# EAGLE design PT08ttl2 (EAGLE 6.6.0)

## Sheet 1 of 2
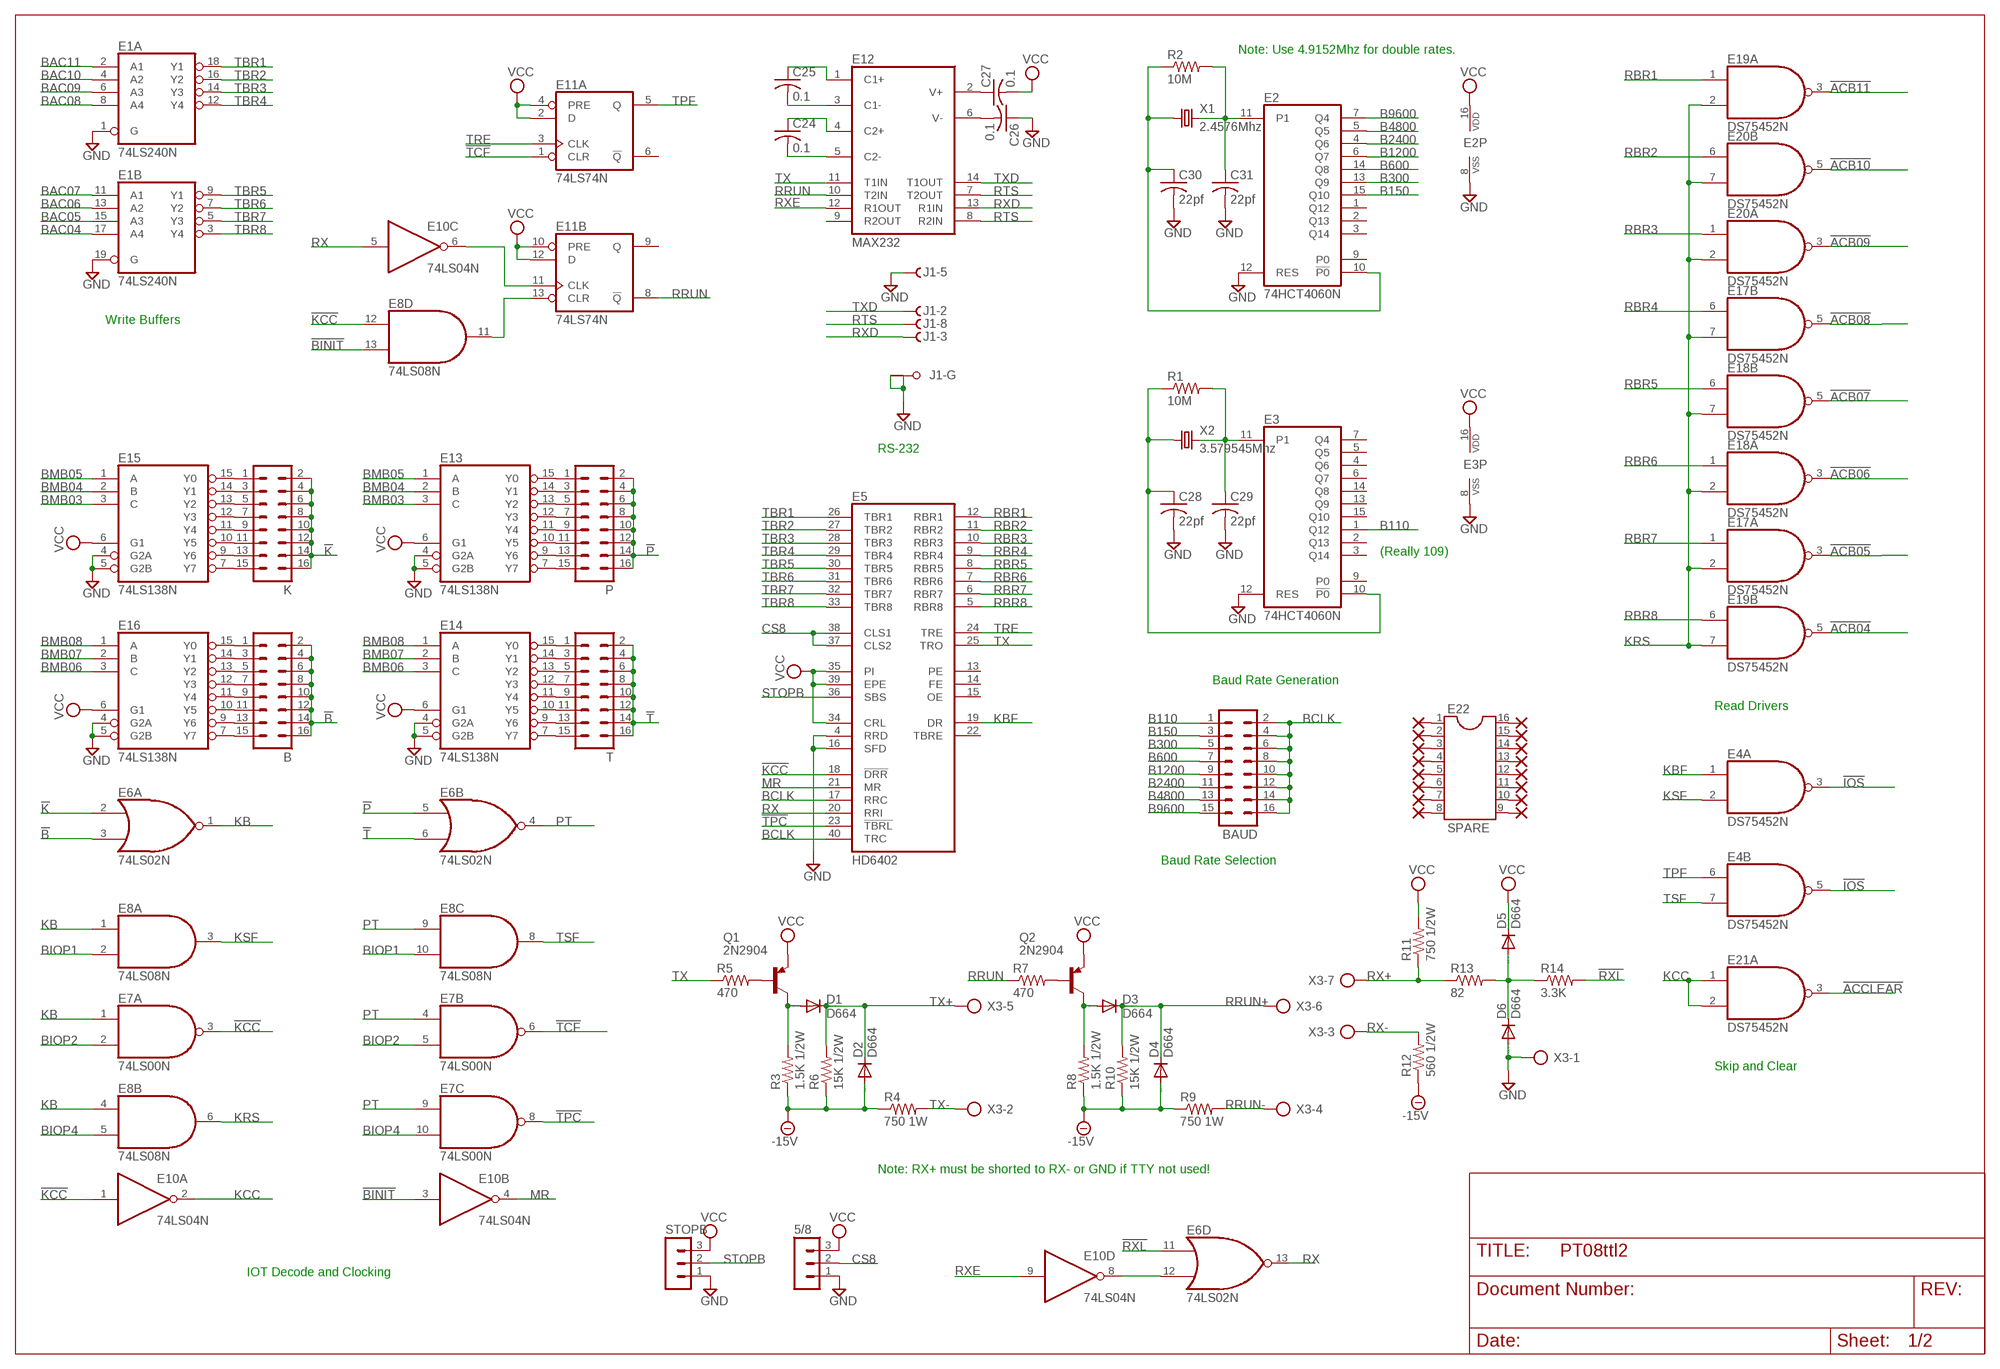
[diagram p0: schematic, sheet 1]

### Parts
5/8  MA03-1  [MA03-1]
B  MA08-2  [MA08-2]
BAUD  MA08-2  [MA08-2]
C24  0.1  C-US050-025X075  [C050-025X075]
C25  0.1  C-US050-025X075  [C050-025X075]
C26  0.1  C-US050-025X075  [C050-025X075]
C27  0.1  C-US050-025X075  [C050-025X075]
C28  22pf  C-US050-025X075  [C050-025X075]
C29  22pf  C-US050-025X075  [C050-025X075]
C30  22pf  C-US050-025X075  [C050-025X075]
C31  22pf  C-US050-025X075  [C050-025X075]
D1  D664  1N4148DO35-10  [DO35-10]
D2  D664  1N4148DO35-10  [DO35-10]
D3  D664  1N4148DO35-10  [DO35-10]
D4  D664  1N4148DO35-10  [DO35-10]
D5  D664  1N4148DO35-10  [DO35-10]
D6  D664  1N4148DO35-10  [DO35-10]
E1  74LS240N  [DIL20]
E2  74HCT4060N  4060N  [DIL16]
E3  74HCT4060N  4060N  [DIL16]
E4  DS75452N  [DIL08]
E5  HD6402  [DIL40]
E6  74LS02N  [DIL14]
E7  74LS00N  [DIL14]
E8  74LS08N  [DIL14]
E10  74LS04N  [DIL14]
E11  74LS74N  [DIL14]
E12  MAX232  [DIL16]
E13  74LS138N  [DIL16]
E14  74LS138N  [DIL16]
E15  74LS138N  [DIL16]
E16  74LS138N  [DIL16]
E17  DS75452N  [DIL08]
E18  DS75452N  [DIL08]
E19  DS75452N  [DIL08]
E20  DS75452N  [DIL08]
E21  DS75452N  [DIL08]
E22  SPARE  DIL16  [DIL16]
J1  F09HPS  [F09HP]
K  MA08-2  [MA08-2]
P  MA08-2  [MA08-2]
PAD18  1,6/0,8  [1,6/0,8]
PAD19  1,6/0,8  [1,6/0,8]
PAD28  1,6/0,8  [1,6/0,8]
PAD29  1,6/0,8  [1,6/0,8]
PAD30  1,6/0,8  [1,6/0,8]
PAD31  1,6/0,8  [1,6/0,8]
PAD32  1,6/0,8  [1,6/0,8]
PAD33  1,6/0,8  [1,6/0,8]
PAD34  1,6/0,8  [1,6/0,8]
PAD35  1,6/0,8  [1,6/0,8]
PAD36  1,6/0,8  [1,6/0,8]
PAD37  1,6/0,8  [1,6/0,8]
PAD38  1,6/0,8  [1,6/0,8]
PAD39  1,6/0,8  [1,6/0,8]
PAD40  1,6/0,8  [1,6/0,8]
PAD41  1,6/0,8  [1,6/0,8]
Q1  2N2904  [TO39]
Q2  2N2904  [TO39]
R1  10M  R-US_0207/10  [0207/10]
R2  10M  R-US_0207/10  [0207/10]
R3  1.5K 1/2W  R-US_0207/10  [0207/10]
R4  750 1W  R-US_0207/10  [0207/10]
R5  470  R-US_0207/10  [0207/10]
R6  15K 1/2W  R-US_0207/10  [0207/10]
R7  470  R-US_0207/10  [0207/10]
R8  1.5K 1/2W  R-US_0207/10  [0207/10]
R9  750 1W  R-US_0207/10  [0207/10]
R10  15K 1/2W  R-US_0207/10  [0207/10]
R11  750 1/2W  R-US_0207/10  [0207/10]
R12  560 1/2W  R-US_0207/10  [0207/10]
R13  82  R-US_0207/10  [0207/10]
R14  3.3K  R-US_0207/10  [0207/10]
STOPB  MA03-1  [MA03-1]
T  MA08-2  [MA08-2]
X1  2.4576Mhz  CRYSTALHC49U-V  [HC49U-V]
X2  3.579545Mhz  CRYSTALHC49U-V  [HC49U-V]
X3  AK300/7  [AK300/7]

### Nets
!ACB04: E19.5(B:O) ; also sheet 2
!ACB05: E17.3(A:O) ; also sheet 2
!ACB06: E18.3(A:O) ; also sheet 2
!ACB07: E18.5(B:O) ; also sheet 2
!ACB08: E17.5(B:O) ; also sheet 2
!ACB09: E20.3(A:O) ; also sheet 2
!ACB10: E20.5(B:O) ; also sheet 2
!ACB11: E19.3(A:O) ; also sheet 2
!ACCLEAR: E21.3(A:O) ; also sheet 2
!B: B.2 B.4 B.6 B.8 B.10 B.12 B.14 B.16 E6.3(A:I1)
!BINIT: E8.13(D:I1) E10.3(B:I) ; also sheet 2
!IOS: E4.3(A:O) E4.5(B:O) ; also sheet 2
!K: E6.2(A:I0) K.2 K.4 K.6 K.8 K.10 K.12 K.14 K.16
!KCC: E5.18(!DRR) E7.3(A:O) E8.12(D:I0) E10.1(A:I)
!P: E6.5(B:I0) P.2 P.4 P.6 P.8 P.10 P.12 P.14 P.16
!RXL: E6.11(D:I0) R14.2
!T: E6.6(B:I1) T.2 T.4 T.6 T.8 T.10 T.12 T.14 T.16
!TCF: E7.6(B:O) E11.1(A:CLR)
!TPC: E5.23(!TBRL) E7.8(C:O)
-15V [supply]: D2.A D4.A R3.1 R4.1 R6.1 R8.1 R9.1 R10.1 R12.1 ; also sheet 2
B110: BAUD.1 E3.1(Q12)
B150: BAUD.3 E2.15(Q10)
B300: BAUD.5 E2.13(Q9)
B600: BAUD.7 E2.14(Q8)
B1200: BAUD.9 E2.6(Q7)
B2400: BAUD.11 E2.4(Q6)
B4800: BAUD.13 E2.5(Q5)
B9600: BAUD.15 E2.7(Q4)
BAC04: E1.17(B:A4) ; also sheet 2
BAC05: E1.15(B:A3) ; also sheet 2
BAC06: E1.13(B:A2) ; also sheet 2
BAC07: E1.11(B:A1) ; also sheet 2
BAC08: E1.8(A:A4) ; also sheet 2
BAC09: E1.6(A:A3) ; also sheet 2
BAC10: E1.4(A:A2) ; also sheet 2
BAC11: E1.2(A:A1) ; also sheet 2
BCLK: BAUD.2 BAUD.4 BAUD.6 BAUD.8 BAUD.10 BAUD.12 BAUD.14 BAUD.16 E5.17(RRC) E5.40(TRC)
BIOP1: E8.2(A:I1) E8.10(C:I1) ; also sheet 2
BIOP2: E7.2(A:I1) E7.5(B:I1) ; also sheet 2
BIOP4: E7.10(C:I1) E8.5(B:I1) ; also sheet 2
BMB03: E13.3(C) E15.3(C) ; also sheet 2
BMB04: E13.2(B) E15.2(B) ; also sheet 2
BMB05: E13.1(A) E15.1(A) ; also sheet 2
BMB06: E14.3(C) E16.3(C) ; also sheet 2
BMB07: E14.2(B) E16.2(B) ; also sheet 2
BMB08: E14.1(A) E16.1(A) ; also sheet 2
CS8: 5/8.2 E5.37(CLS2) E5.38(CLS1)
GND [supply]: 5/8.1 C26.1 C28.2 C29.2 C30.2 C31.2 D6.A E1.1(A:G) E1.19(B:G) E2.8(VSS) E2.12(RES) E3.8(VSS) E3.12(RES) E5.4(RRD) E5.16(SFD) E13.4(G2A) E13.5(G2B) E14.4(G2A) E14.5(G2B) E15.4(G2A) E15.5(G2B) E16.4(G2A) E16.5(G2B) J1.5(-5:F) J1.G1(-G:G1) J1.G2(-G:G2) STOPB.1 X3.1 ; also sheet 2
KB: E6.1(A:O) E7.1(A:I0) E8.1(A:I0) E8.4(B:I0)
KBF: E4.1(A:I0) E5.19(DR)
KCC: E10.2(A:O) E21.1(A:I0) E21.2(A:I1)
KRS: E8.6(B:O) E17.2(A:I1) E17.7(B:I1) E18.2(A:I1) E18.7(B:I1) E19.2(A:I1) E19.7(B:I1) E20.2(A:I1) E20.7(B:I1)
KSF: E4.2(A:I1) E8.3(A:O)
MR: E5.21(MR) E10.4(B:O)
N$1: B.13 E16.9(Y6)
N$5: B.1 E16.15(Y0)
N$6: B.3 E16.14(Y1)
N$7: B.5 E16.13(Y2)
N$8: B.7 E16.12(Y3)
N$9: B.9 E16.11(Y4)
N$10: B.11 E16.10(Y5)
N$11: B.15 E16.7(Y7)
N$13: C29.1 E3.11(P1) R1.2 X2.2
N$14: C28.1 E3.10(!P0) R1.1 X2.1
N$15 [supply]: C26.2 E12.6(V-)
N$16 [supply]: C27.1 E12.2(V+)
N$17: Q1.2(B) R5.2
N$18: D1.A Q1.3(C) R3.2
N$19: Q2.2(B) R7.2
N$20: D3.A Q2.3(C) R8.2
N$22: C24.2 E12.5(C2-)
N$23: C30.1 E2.10(!P0) R2.1 X1.1
N$24: D5.A D6.C R13.2 R14.1
N$25: C31.1 E2.11(P1) R2.2 X1.2
N$26: E8.11(D:O) E11.13(B:CLR)
N$27: E6.12(D:I1) E10.8(D:O)
N$29: E10.6(C:O) E11.11(B:CLK)
N$32: C25.2 E12.3(C1-)
N$34: E22.1 PAD18.1(P)
N$41: E22.2 PAD19.1(P)
N$43: E22.3 PAD28.1(P)
N$44: C24.1 E12.4(C2+)
N$45: C25.1 E12.1(C1+)
N$49: E14.15(Y0) T.1
N$50: E22.4 PAD29.1(P)
N$51: E22.5 PAD30.1(P)
N$52: E22.6 PAD31.1(P)
N$53: E22.7 PAD32.1(P)
N$54: E22.8 PAD33.1(P)
N$55: E22.16 PAD34.1(P)
N$56: E22.15 PAD35.1(P)
N$57: E22.14 PAD36.1(P)
N$58: E22.13 PAD37.1(P)
N$59: E22.12 PAD38.1(P)
N$61: E22.11 PAD39.1(P)
N$68: E22.10 PAD40.1(P)
N$69: E22.9 PAD41.1(P)
N$90: E15.15(Y0) K.1
N$91: E15.14(Y1) K.3
N$97: E15.13(Y2) K.5
N$109: E15.12(Y3) K.7
N$112: E15.11(Y4) K.9
N$113: E15.10(Y5) K.11
N$114: E15.7(Y7) K.15
N$115: E15.9(Y6) K.13
N$116: E14.14(Y1) T.3
N$117: E14.13(Y2) T.5
N$118: E14.12(Y3) T.7
N$119: E14.11(Y4) T.9
N$120: E14.10(Y5) T.11
N$121: E14.7(Y7) T.15
N$122: E14.9(Y6) T.13
N$123: E13.15(Y0) P.1
N$124: E13.14(Y1) P.3
N$125: E13.13(Y2) P.5
N$126: E13.12(Y3) P.7
N$127: E13.11(Y4) P.9
N$128: E13.10(Y5) P.11
N$129: E13.7(Y7) P.15
N$130: E13.9(Y6) P.13
PT: E6.4(B:O) E7.4(B:I0) E7.9(C:I0) E8.9(C:I0)
RBR1: E5.12(RBR1) E19.1(A:I0)
RBR2: E5.11(RBR2) E20.6(B:I0)
RBR3: E5.10(RBR3) E20.1(A:I0)
RBR4: E5.9(RBR4) E17.6(B:I0)
RBR5: E5.8(RBR5) E18.6(B:I0)
RBR6: E5.7(RBR6) E18.1(A:I0)
RBR7: E5.6(RBR7) E17.1(A:I0)
RBR8: E5.5(RBR8) E19.6(B:I0)
RRUN: E11.8(B:!Q) E12.10(T2IN) R7.1
RRUN+: D3.C D4.C R10.2 X3.6
RRUN-: R9.2 X3.4
RTS: E12.7(T2OUT) E12.8(R2IN) J1.8(-8:F)
RX: E5.20(RRI) E6.13(D:O) E10.5(C:I)
RX+: R11.1 R13.1 X3.7
RX-: R12.2 X3.3
RXD: E12.13(R1IN) J1.3(-3:F)
RXE: E10.9(D:I) E12.12(R1OUT)
STOPB: E5.36(SBS) STOPB.2
TBR1: E1.18(A:Y1) E5.26(TBR1)
TBR2: E1.16(A:Y2) E5.27(TBR2)
TBR3: E1.14(A:Y3) E5.28(TBR3)
TBR4: E1.12(A:Y4) E5.29(TBR4)
TBR5: E1.9(B:Y1) E5.30(TBR5)
TBR6: E1.7(B:Y2) E5.31(TBR6)
TBR7: E1.5(B:Y3) E5.32(TBR7)
TBR8: E1.3(B:Y4) E5.33(TBR8)
TPF: E4.6(B:I0) E11.5(A:Q)
TRE: E5.24(TRE) E11.3(A:CLK)
TSF: E4.7(B:I1) E8.8(C:O)
TX: E5.25(TRO) E12.11(T1IN) R5.1
TX+: D1.C D2.C R6.2 X3.5
TX-: R4.2 X3.2
TXD: E12.14(T1OUT) J1.2(-2:F)
VCC [supply]: 5/8.3 C27.2 D5.C E2.16(VDD) E3.16(VDD) E5.34(CRL) E5.35(PI) E5.39(EPE) E11.2(A:D) E11.4(A:PRE) E11.10(B:PRE) E11.12(B:D) E13.6(G1) E14.6(G1) E15.6(G1) E16.6(G1) Q1.1(E) Q2.1(E) R11.2 STOPB.3 ; also sheet 2
Unconnected: E2.1(Q12) E2.2(Q13) E2.3(Q14) E2.9(P0) E3.2(Q13) E3.3(Q14) E3.4(Q6) E3.5(Q5) E3.6(Q7) E3.7(Q4) E3.9(P0) E3.13(Q9) E3.14(Q8) E3.15(Q10) E5.13(PE) E5.14(FE) E5.15(OE) E5.22(TBRE) E11.6(A:!Q) E11.9(B:Q) E12.9(R2OUT) J1.1(-1:F) J1.4(-4:F) J1.6(-6:F) J1.7(-7:F) J1.9(-9:F)

### Notes on the sheet
- Note: Use 4.9152Mhz for double rates.
- Write Buffers
- RS-232
- (Really 109)
- Baud Rate Generation
- Read Drivers
- Baud Rate Selection
- Skip and Clear
- Note: RX+ must be shorted to RX- or GND if TTY not used!
- IOT Decode and Clocking

## Sheet 2 of 2
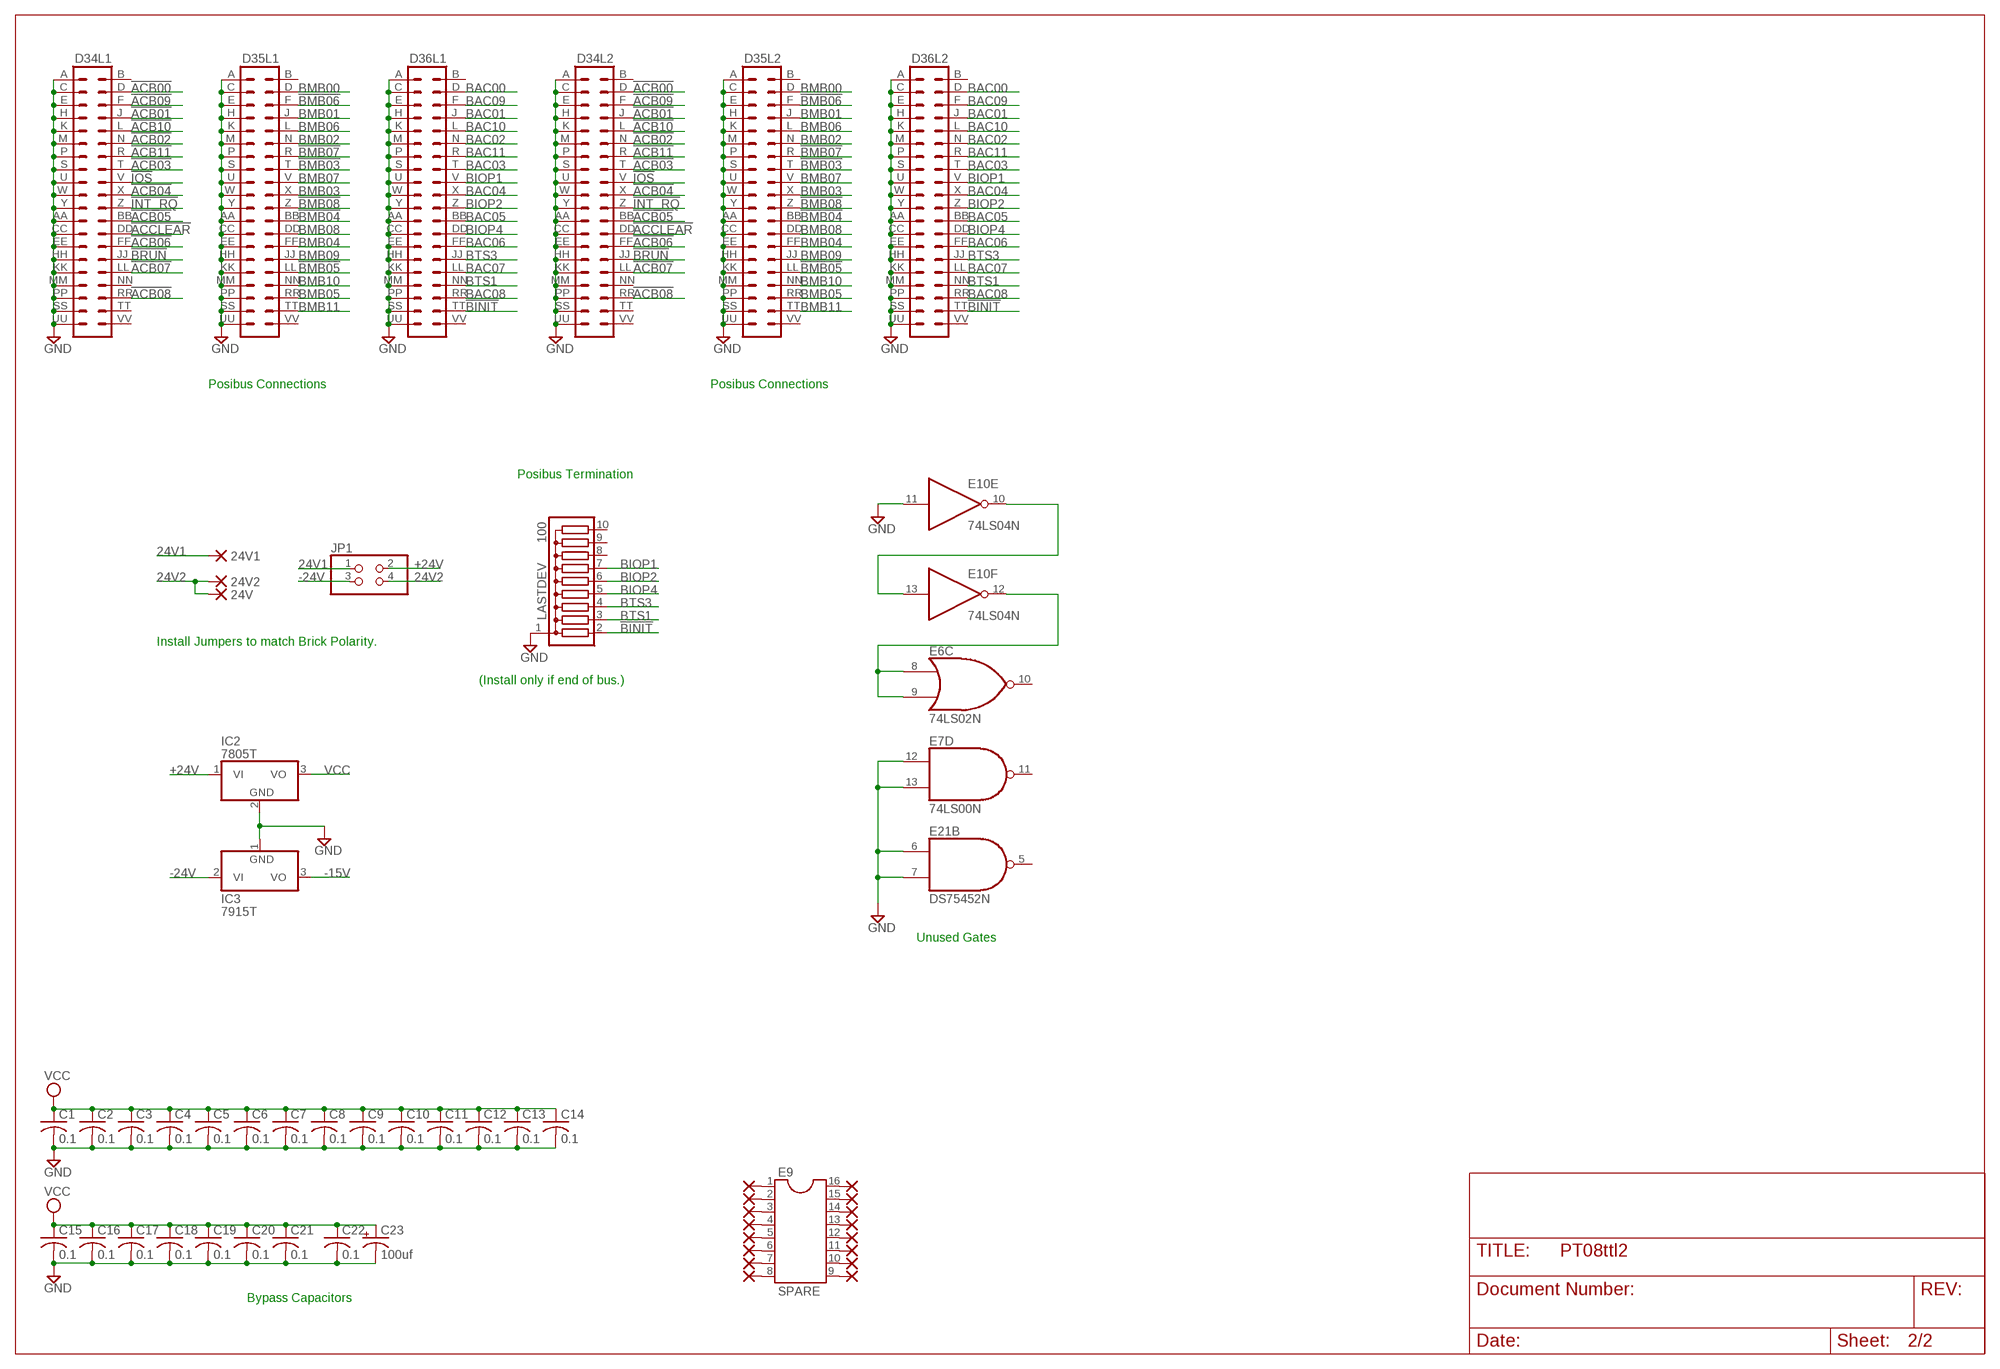
[diagram p1: schematic, sheet 2]

### Parts
24V  PAD-0820  [0820]
24V1  PAD-0820  [0820]
24V2  PAD-0820  [0820]
C1  0.1  C-US050-025X075  [C050-025X075]
C2  0.1  C-US050-025X075  [C050-025X075]
C3  0.1  C-US050-025X075  [C050-025X075]
C4  0.1  C-US050-025X075  [C050-025X075]
C5  0.1  C-US050-025X075  [C050-025X075]
C6  0.1  C-US050-025X075  [C050-025X075]
C7  0.1  C-US050-025X075  [C050-025X075]
C8  0.1  C-US050-025X075  [C050-025X075]
C9  0.1  C-US050-025X075  [C050-025X075]
C10  0.1  C-US050-025X075  [C050-025X075]
C11  0.1  C-US050-025X075  [C050-025X075]
C12  0.1  C-US050-025X075  [C050-025X075]
C13  0.1  C-US050-025X075  [C050-025X075]
C14  0.1  C-US050-025X075  [C050-025X075]
C15  0.1  C-US050-025X075  [C050-025X075]
C16  0.1  C-US050-025X075  [C050-025X075]
C17  0.1  C-US050-025X075  [C050-025X075]
C18  0.1  C-US050-025X075  [C050-025X075]
C19  0.1  C-US050-025X075  [C050-025X075]
C20  0.1  C-US050-025X075  [C050-025X075]
C21  0.1  C-US050-025X075  [C050-025X075]
C22  0.1  C-US050-025X075  [C050-025X075]
C23  100uf  CPOL-USE22-9AXIAL  [E22-9]
D34L1  DEC40PINV  [DEC40PINV]
D34L2  DEC40PINV  [DEC40PINV]
D35L1  DEC40PINV  [DEC40PINV]
D35L2  DEC40PINV  [DEC40PINV]
D36L1  DEC40PINV  [DEC40PINV]
D36L2  DEC40PINV  [DEC40PINV]
E9  SPARE  DIL16  [DIL16]
IC2  7805T  [TO220H]
IC3  7915T  [TO220H]
JP1  PINHD-2X2  [2X02]
LASTDEV  100  G09R  [SIL10]
PAD1  1,6/0,8  [1,6/0,8]
PAD2  1,6/0,8  [1,6/0,8]
PAD3  1,6/0,8  [1,6/0,8]
PAD4  1,6/0,8  [1,6/0,8]
PAD5  1,6/0,8  [1,6/0,8]
PAD6  1,6/0,8  [1,6/0,8]
PAD7  1,6/0,8  [1,6/0,8]
PAD8  1,6/0,8  [1,6/0,8]
PAD9  1,6/0,8  [1,6/0,8]
PAD42  1,6/0,8  [1,6/0,8]
PAD43  1,6/0,8  [1,6/0,8]
PAD44  1,6/0,8  [1,6/0,8]
PAD45  1,6/0,8  [1,6/0,8]
PAD46  1,6/0,8  [1,6/0,8]
PAD47  1,6/0,8  [1,6/0,8]
PAD48  1,6/0,8  [1,6/0,8]

### Nets
24V1 [supply]: 24V1.P$1(P) JP1.1
24V2 [supply]: 24V2.P$1(P) 24V.P$1(P) JP1.4
!ACB00: D34L1.D D34L2.D
!ACB01: D34L1.J D34L2.J
!ACB02: D34L1.N D34L2.N
!ACB03: D34L1.T D34L2.T
!ACB04: D34L1.X D34L2.X ; also sheet 1
!ACB05: D34L1.BB D34L2.BB ; also sheet 1
!ACB06: D34L1.FF D34L2.FF ; also sheet 1
!ACB07: D34L1.LL D34L2.LL ; also sheet 1
!ACB08: D34L1.RR D34L2.RR ; also sheet 1
!ACB09: D34L1.F D34L2.F ; also sheet 1
!ACB10: D34L1.L D34L2.L ; also sheet 1
!ACB11: D34L1.R D34L2.R ; also sheet 1
!ACCLEAR: D34L1.DD D34L2.DD ; also sheet 1
!BINIT: D36L1.TT D36L2.TT LASTDEV.2 ; also sheet 1
!BMB03: D35L1.T D35L2.T
!BMB04: D35L1.BB D35L2.BB
!BMB05: D35L1.LL D35L2.LL
!BMB06: D35L1.F D35L2.F
!BMB07: D35L1.R D35L2.R
!BMB08: D35L1.Z D35L2.Z
!BRUN: D34L1.JJ D34L2.JJ
!INT_RQ: D34L1.Z D34L2.Z
!IOS: D34L1.V D34L2.V ; also sheet 1
+24V [supply]: IC2.1(VI) JP1.2
-15V [supply]: IC3.3(VO) ; also sheet 1
-24V [supply]: IC3.2(VI) JP1.3
BAC00: D36L1.D D36L2.D
BAC01: D36L1.J D36L2.J
BAC02: D36L1.N D36L2.N
BAC03: D36L1.T D36L2.T
BAC04: D36L1.X D36L2.X ; also sheet 1
BAC05: D36L1.BB D36L2.BB ; also sheet 1
BAC06: D36L1.FF D36L2.FF ; also sheet 1
BAC07: D36L1.LL D36L2.LL ; also sheet 1
BAC08: D36L1.RR D36L2.RR ; also sheet 1
BAC09: D36L1.F D36L2.F ; also sheet 1
BAC10: D36L1.L D36L2.L ; also sheet 1
BAC11: D36L1.R D36L2.R ; also sheet 1
BIOP1: D36L1.V D36L2.V LASTDEV.7 ; also sheet 1
BIOP2: D36L1.Z D36L2.Z LASTDEV.6 ; also sheet 1
BIOP4: D36L1.DD D36L2.DD LASTDEV.5 ; also sheet 1
BMB00: D35L1.D D35L2.D
BMB01: D35L1.J D35L2.J
BMB02: D35L1.N D35L2.N
BMB03: D35L1.X D35L2.X ; also sheet 1
BMB04: D35L1.FF D35L2.FF ; also sheet 1
BMB05: D35L1.RR D35L2.RR ; also sheet 1
BMB06: D35L1.L D35L2.L ; also sheet 1
BMB07: D35L1.V D35L2.V ; also sheet 1
BMB08: D35L1.DD D35L2.DD ; also sheet 1
BMB09: D35L1.JJ D35L2.JJ
BMB10: D35L1.NN D35L2.NN
BMB11: D35L1.TT D35L2.TT
BTS1: D36L1.NN D36L2.NN LASTDEV.3
BTS3: D36L1.JJ D36L2.JJ LASTDEV.4
GND [supply]: C1.2 C2.2 C3.2 C4.2 C5.2 C6.2 C7.2 C8.2 C9.2 C10.2 C11.2 C12.2 C13.2 C14.2 C15.2 C16.2 C17.2 C18.2 C19.2 C20.2 C21.2 C22.2 C23.- D34L1.A D34L1.AA D34L1.C D34L1.CC D34L1.E D34L1.EE D34L1.H D34L1.HH D34L1.K D34L1.KK D34L1.M D34L1.MM D34L1.P D34L1.PP D34L1.S D34L1.SS D34L1.U D34L1.UU D34L1.W D34L1.Y D34L2.A D34L2.AA D34L2.C D34L2.CC D34L2.E D34L2.EE D34L2.H D34L2.HH D34L2.K D34L2.KK D34L2.M D34L2.MM D34L2.P D34L2.PP D34L2.S D34L2.SS D34L2.U D34L2.UU D34L2.W D34L2.Y D35L1.A D35L1.AA D35L1.C D35L1.CC D35L1.E D35L1.EE D35L1.H D35L1.HH D35L1.K D35L1.KK D35L1.M D35L1.MM D35L1.P D35L1.PP D35L1.S D35L1.SS D35L1.U D35L1.UU D35L1.W D35L1.Y D35L2.A D35L2.AA D35L2.C D35L2.CC D35L2.E D35L2.EE D35L2.H D35L2.HH D35L2.K D35L2.KK D35L2.M D35L2.MM D35L2.P D35L2.PP D35L2.S D35L2.SS D35L2.U D35L2.UU D35L2.W D35L2.Y D36L1.A D36L1.AA D36L1.C D36L1.CC D36L1.E D36L1.EE D36L1.H D36L1.HH D36L1.K D36L1.KK D36L1.M D36L1.MM D36L1.P D36L1.PP D36L1.S D36L1.SS D36L1.U D36L1.UU D36L1.W D36L1.Y D36L2.A D36L2.AA D36L2.C D36L2.CC D36L2.E D36L2.EE D36L2.H D36L2.HH D36L2.K D36L2.KK D36L2.M D36L2.MM D36L2.P D36L2.PP D36L2.S D36L2.SS D36L2.U D36L2.UU D36L2.W D36L2.Y E7.12(D:I0) E7.13(D:I1) E10.11(E:I) E21.6(B:I0) E21.7(B:I1) IC2.2(GND) IC3.1(GND) LASTDEV.1 ; also sheet 1
N$2: E9.1 PAD1.1(P)
N$3: E9.2 PAD2.1(P)
N$4: E9.3 PAD3.1(P)
N$12: E9.4 PAD4.1(P)
N$21: E9.5 PAD5.1(P)
N$30 [supply]: E10.10(E:O) E10.13(F:I)
N$31: E9.6 PAD6.1(P)
N$33: E9.7 PAD7.1(P)
N$35: E9.8 PAD8.1(P)
N$37: E9.16 PAD9.1(P)
N$38: E9.15 PAD42.1(P)
N$39: E9.14 PAD43.1(P)
N$40: E9.13 PAD44.1(P)
N$42: E9.12 PAD45.1(P)
N$46: E9.11 PAD46.1(P)
N$47: E9.10 PAD47.1(P)
N$48: E9.9 PAD48.1(P)
N$60 [supply]: E6.8(C:I0) E6.9(C:I1) E10.12(F:O)
VCC [supply]: C1.1 C2.1 C3.1 C4.1 C5.1 C6.1 C7.1 C8.1 C9.1 C10.1 C11.1 C12.1 C13.1 C14.1 C15.1 C16.1 C17.1 C18.1 C19.1 C20.1 C21.1 C22.1 C23.+ IC2.3(VO) ; also sheet 1
Unconnected: D34L1.B D34L1.NN D34L1.TT D34L1.VV D34L2.B D34L2.NN D34L2.TT D34L2.VV D35L1.B D35L1.VV D35L2.B D35L2.VV D36L1.B D36L1.VV D36L2.B D36L2.VV E6.10(C:O) E7.11(D:O) E21.5(B:O) LASTDEV.8 LASTDEV.9 LASTDEV.10

### Notes on the sheet
- Posibus Connections | Posibus Connections
- Posibus Termination
- Install Jumpers to match Brick Polarity.
- (Install only if end of bus.)
- Unused Gates
- Bypass Capacitors

## Power pins joined to a net without a drawn wire
GND: E1.10(P:GND) E4.4(P:GND) E5.3(GND) E6.7(P:GND) E7.7(P:GND) E8.7(P:GND) E10.7(P:GND) E11.7(P:GND) E12.15(GND) E13.8(GND) E14.8(GND) E15.8(GND) E16.8(GND) E17.4(P:GND) E18.4(P:GND) E19.4(P:GND) E20.4(P:GND) E21.4(P:GND)
VCC: E1.20(P:VCC) E4.8(P:VCC) E5.1(VCC) E6.14(P:VCC) E7.14(P:VCC) E8.14(P:VCC) E10.14(P:VCC) E11.14(P:VCC) E12.16(VCC) E13.16(VCC) E14.16(VCC) E15.16(VCC) E16.16(VCC) E17.8(P:VCC) E18.8(P:VCC) E19.8(P:VCC) E20.8(P:VCC) E21.8(P:VCC)

## Library data of the parts
5/8 STOPB = con-lstb:MA03-1: PIN HEADER; OC_FARNELL: unknown; OC_NEWARK: unknown
24V 24V1 24V2 = dec-con:PAD: WIRE PAD Standard US Drill Sizes
B BAUD K P T = con-lstb:MA08-2: PIN HEADER; OC_FARNELL: unknown; OC_NEWARK: unknown
C1-C22 C24-C31 = rcl:C-US: CAPACITOR, American symbol
C23 = rcl:CPOL-US: POLARIZED CAPACITOR, American symbol
D1-D6 = diode:1N4148: DIODE high speed (Philips)
D34L1 D34L2 D35L1 D35L2 D36L1 D36L2 = dec-con:DEC40PIN: PIN HEADER
E1 = 74xx-us:74*240: Octal BUFFER and LINE DRIVER, 3-state
E2 E3 = 40xx:4060: 14-stage binary/ripple COUNTER
E4 E17-E21 = dec-con:DS75452: Quad 2-input NAND gate, open collector output
E5 = micro-harris:HD6402: MICROCONTROLLER/MEMORY DEVICE; OC_FARNELL: unknown; OC_NEWARK: unknown
E6 = 74xx-us:74*02: Quad 2-input NOR gate
E7 = 74xx-us:74*00: Quad 2-input NAND gate
E8 = 74xx-us:74*08: Quad 2-input AND gate
E9 E22 = ic-package:DIL16: Dual In Line / Socket
E10 = 74xx-us:74*04: Hex INVERTER
E11 = 74xx-us:74*74: Dual D type positive edge triggered FLIP FLOP, preset and clear
E12 = maxim:MAX232: RS232 TRANSCEIVER; MF: MAXIM; MPN: MAX232ACPE+; OC_FARNELL: 9723773; OC_NEWARK: 68K4544
E13-E16 = 74xx-us:74*138: 3-line to 8-line DECODER/DEMULTIPLEXER
IC2 = linear:78*: Positive VOLTAGE REGULATOR Source: http://cache.national.com/ds/LM/LM78L05.pdf http://www.fairchildsemi.com/ds/LM/LM7805.pdf
IC3 = linear:79*: Negative VOLTAGE REGULATOR
J1 = con-subd:F09HPS: SUB-D; OC_FARNELL: unknown; OC_NEWARK: unknown
JP1 = pinhead:PINHD-2X2: PIN HEADER
LASTDEV = resistor-sil:G09R: SIL RESISTOR; OC_FARNELL: unknown; OC_NEWARK: unknown
PAD1-PAD9 PAD18 PAD19 PAD28-PAD48 = wirepad:1,6/0,8: THROUGH-HOLE PAD
Q1 Q2 = transistor-pnp:2N2904*: PNP Transistror
R1-R14 = rcl:R-US_: RESISTOR, American symbol
X1 X2 = crystal:CRYSTAL: CRYSTAL; OC_FARNELL: 1666969; OC_NEWARK: unknown
X3 = con-ptr500:AK300/7: CONNECTOR; OC_FARNELL: unknown; OC_NEWARK: unknown

## Net classes
1 supply: width 0.508 mm

## Board
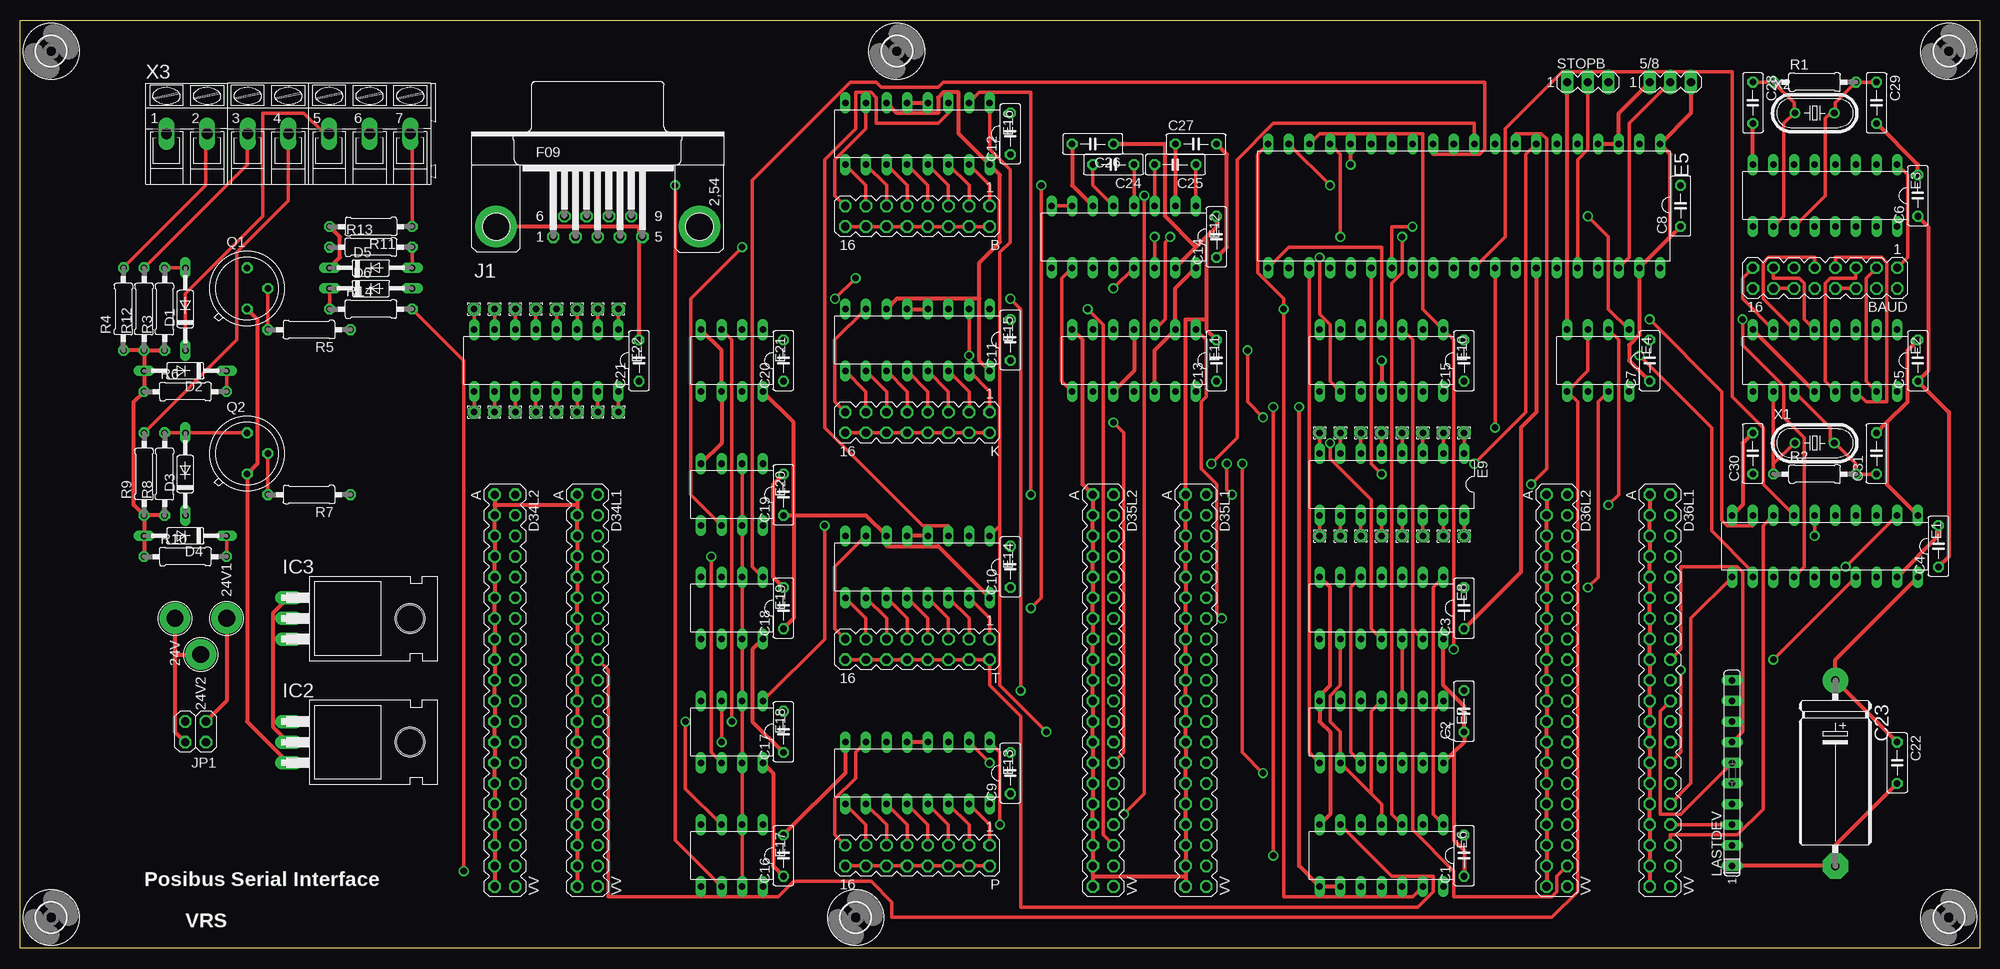
[diagram p2: board, top side]
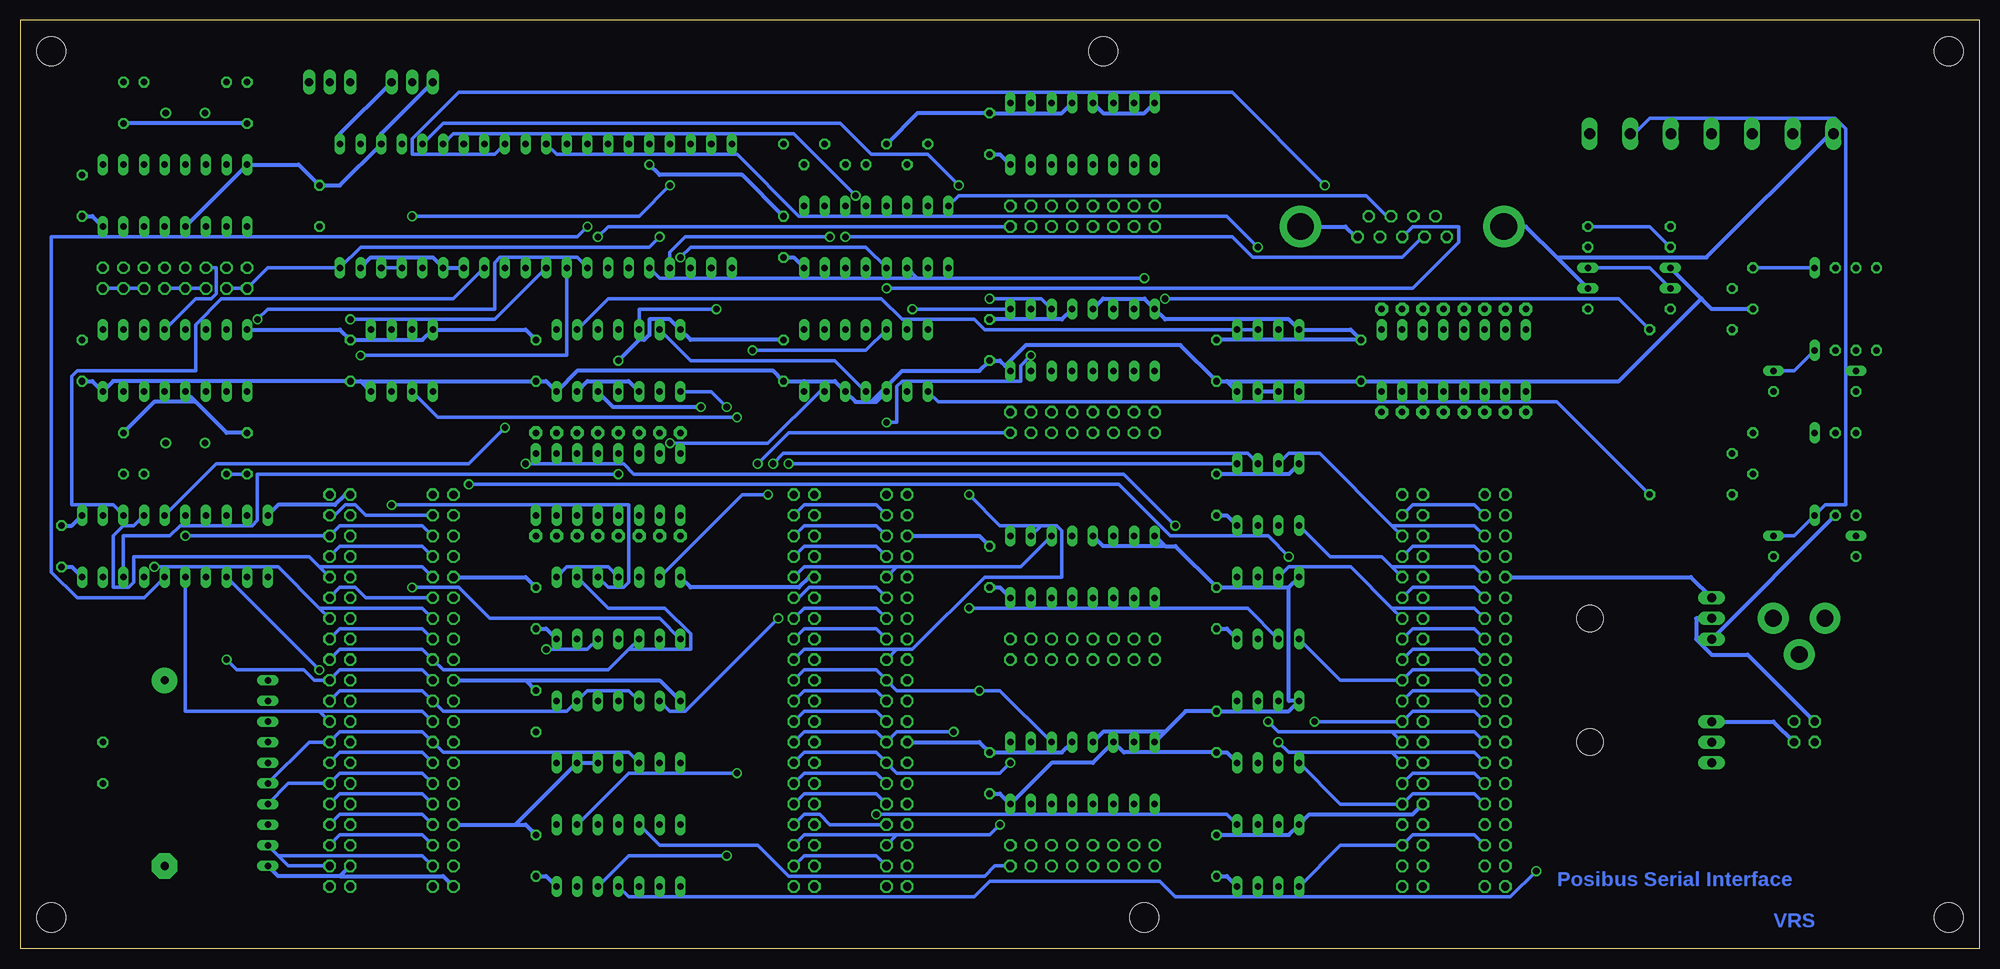
[diagram p3: board, bottom side, seen from below]

Size 241.3 x 114.3 mm. Coordinates in mm from the lower left corner, seen from the top.
Outline: 0,0 0,114.3 241.3,114.3 241.3,0 0,0
Copper layers (1+16): Top 0.035mm / dielectric 1.5mm / Bottom 0.035mm
Design rules "16mils": minimum track width 16mil, minimum drill 32mil, track to track 15mil, track to pad 10mil, pad to pad 10mil, via to via 10mil, smd to smd 10mil, copper to edge 13mil, drill to drill 10mil, minimum pad ring 10mil, minimum via ring 8mil, stop-mask expansion 0mil, vias tented up to drill 0mil, thermal gap 10mil

### Footprints (pad centres in the part's own frame; a part is rotated, then mirrored left to right if it is on the bottom)
MA03-1 = drill 1.016 long: 1 -2.54,0; 2 0,0; 3 2.54,0
0820 = drill 2.083 pad 3.81: P$1 0,0
MA08-2 = drill 1.016 octagon: 1 -8.89,-1.27; 2 -8.89,1.27; 3 -6.35,-1.27; 4 -6.35,1.27; 5 -3.81,-1.27; 6 -3.81,1.27; 7 -1.27,-1.27; 8 -1.27,1.27; 9 1.27,-1.27; 10 1.27,1.27; 11 3.81,-1.27; 12 3.81,1.27; 13 6.35,-1.27; 14 6.35,1.27; 15 8.89,-1.27; 16 8.89,1.27
C050-025X075 = drill 0.813 octagon: 1 -2.54,0; 2 2.54,0
E22-9 = drill 1.016 pad 3.15: + -11.43,0 | drill 1.016 pad 3.15 octagon: - 11.43,0
DO35-10 = drill 0.813 long: A 5.08,0; C -5.08,0
DEC40PINV = drill 1.016 octagon: A -24.13,-1.27; AA 3.81,-1.27; B -24.13,1.27; BB 3.81,1.27; C -21.59,-1.27; CC 6.35,-1.27; D -21.59,1.27; DD 6.35,1.27; E -19.05,-1.27; EE 8.89,-1.27; F -19.05,1.27; FF 8.89,1.27; H -16.51,-1.27; HH 11.43,-1.27; J -16.51,1.27; JJ 11.43,1.27; K -13.97,-1.27; KK 13.97,-1.27; L -13.97,1.27; LL 13.97,1.27; M -11.43,-1.27; MM 16.51,-1.27; N -11.43,1.27; NN 16.51,1.27; P -8.89,-1.27; PP 19.05,-1.27; R -8.89,1.27; RR 19.05,1.27; S -6.35,-1.27; SS 21.59,-1.27; T -6.35,1.27; TT 21.59,1.27; U -3.81,-1.27; UU 24.13,-1.27; V -3.81,1.27; VV 24.13,1.27; W -1.27,-1.27; X -1.27,1.27; Y 1.27,-1.27; Z 1.27,1.27
DIL20 = drill 0.813 long: 1 -11.43,-3.81; 2 -8.89,-3.81; 3 -6.35,-3.81; 4 -3.81,-3.81; 5 -1.27,-3.81; 6 1.27,-3.81; 7 3.81,-3.81; 8 6.35,-3.81; 9 8.89,-3.81; 10 11.43,-3.81; 11 11.43,3.81; 12 8.89,3.81; 13 6.35,3.81; 14 3.81,3.81; 15 1.27,3.81; 16 -1.27,3.81; 17 -3.81,3.81; 18 -6.35,3.81; 19 -8.89,3.81; 20 -11.43,3.81
DIL16 = drill 0.813 long: 1 -8.89,-3.81; 2 -6.35,-3.81; 3 -3.81,-3.81; 4 -1.27,-3.81; 5 1.27,-3.81; 6 3.81,-3.81; 7 6.35,-3.81; 8 8.89,-3.81; 9 8.89,3.81; 10 6.35,3.81; 11 3.81,3.81; 12 1.27,3.81; 13 -1.27,3.81; 14 -3.81,3.81; 15 -6.35,3.81; 16 -8.89,3.81
DIL08 = drill 0.813 long: 1 -3.81,-3.81; 2 -1.27,-3.81; 3 1.27,-3.81; 4 3.81,-3.81; 5 3.81,3.81; 6 1.27,3.81; 7 -1.27,3.81; 8 -3.81,3.81
DIL40 = drill 0.813 long: 1 -24.13,-7.62; 2 -21.59,-7.62; 3 -19.05,-7.62; 4 -16.51,-7.62; 5 -13.97,-7.62; 6 -11.43,-7.62; 7 -8.89,-7.62; 8 -6.35,-7.62; 9 -3.81,-7.62; 10 -1.27,-7.62; 11 1.27,-7.62; 12 3.81,-7.62; 13 6.35,-7.62; 14 8.89,-7.62; 15 11.43,-7.62; 16 13.97,-7.62; 17 16.51,-7.62; 18 19.05,-7.62; 19 21.59,-7.62; 20 24.13,-7.62; 21 24.13,7.62; 22 21.59,7.62; 23 19.05,7.62; 24 16.51,7.62; 25 13.97,7.62; 26 11.43,7.62; 27 8.89,7.62; 28 6.35,7.62; 29 3.81,7.62; 30 1.27,7.62; 31 -1.27,7.62; 32 -3.81,7.62; 33 -6.35,7.62; 34 -8.89,7.62; 35 -11.43,7.62; 36 -13.97,7.62; 37 -16.51,7.62; 38 -19.05,7.62; 39 -21.59,7.62; 40 -24.13,7.62
DIL14 = drill 0.813 long: 1 -7.62,-3.81; 2 -5.08,-3.81; 3 -2.54,-3.81; 4 0,-3.81; 5 2.54,-3.81; 6 5.08,-3.81; 7 7.62,-3.81; 8 7.62,3.81; 9 5.08,3.81; 10 2.54,3.81; 11 0,3.81; 12 -2.54,3.81; 13 -5.08,3.81; 14 -7.62,3.81
TO220H = drill 1.118 long: 1 -2.54,-10.16; 2 0,-10.16; 3 2.54,-10.16 | hole 3.302: 0,4.826
F09HP = drill 1.016 octagon: 1 -5.486,-1.27; 2 -2.743,-1.27; 3 0,-1.27; 4 2.743,-1.27; 5 5.486,-1.27; 6 -4.115,1.27; 7 -1.372,1.27; 8 1.372,1.27; 9 4.115,1.27 | drill 3.302 pad 5.08: G1 -12.522,0; G2 12.522,0
2X02 = drill 1.016 octagon: 1 -1.27,-1.27; 2 -1.27,1.27; 3 1.27,-1.27; 4 1.27,1.27
SIL10 = drill 0.813 long: 1 -11.43,0; 2 -8.89,0; 3 -6.35,0; 4 -3.81,0; 5 -1.27,0; 6 1.27,0; 7 3.81,0; 8 6.35,0; 9 8.89,0; 10 11.43,0
1,6/0,8 = drill 0.813 pad 1.6 octagon: 1 0,0
TO39 = drill 0.813 octagon: 1 0,-2.54; 2 2.54,0; 3 0,2.54
0207/10 = drill 0.813 octagon: 1 -5.08,0; 2 5.08,0
3,6 = hole 3.6: 0,0
HC49U-V = drill 0.813: 1 -2.413,0; 2 2.413,0
AK300/7 = drill 1.321 long: 1 -15.011,0; 2 -10.008,0; 3 -5.004,0; 4 0,0; 5 5.004,0; 6 10.008,0; 7 15.011,0

### Placement (x,y rotation side)
5/8  203.2,106.68 0 top
24V  19.05,40.64 270 top
24V1  25.4,40.64 90 top
24V2  22.23,36.2 270 top
B  110.49,90.17 180 top
BAUD  222.25,82.55 180 top
C1  177.8,11.43 90 top
C2  177.8,29.21 90 top
C3  177.8,41.91 90 top
C4  236.22,49.53 90 top
C5  233.68,72.39 90 top
C6  233.68,92.71 90 top
C7  200.66,72.39 90 top
C8  204.47,91.44 90 top
C9  121.92,21.59 90 top
C10  121.92,46.99 90 top
C11  121.92,74.93 90 top
C12  121.92,100.33 90 top
C13  147.32,72.39 90 top
C14  147.32,87.63 90 top
C15  177.8,72.39 90 top
C16  93.98,11.43 90 top
C17  93.98,26.67 90 top
C18  93.98,41.91 90 top
C19  93.98,55.88 90 top
C20  93.98,72.39 90 top
C21  76.2,72.39 90 top
C22  231.14,22.86 270 top
C23  223.52,21.59 270 top
C24  134.62,96.52 180 top
C25  142.24,96.52 180 top
C26  132.08,99.06 180 top
C27  144.78,99.06 0 top
C28  213.36,104.14 270 top
C29  228.6,104.14 270 top
C30  213.36,60.96 90 top
C31  228.6,60.96 90 top
D1  20.32,78.74 90 top
D2  20.32,71.12 180 top
D3  20.32,58.42 90 top
D4  20.32,50.8 180 top
D5  43.18,83.82 0 top
D6  43.18,81.28 0 top
D34L1  69.85,31.75 270 top
D34L2  59.69,31.75 270 top
D35L1  144.78,31.75 270 top
D35L2  133.35,31.75 270 top
D36L1  201.93,31.75 270 top
D36L2  189.23,31.75 270 top
E1  222.25,49.53 180 top
E2  222.25,72.39 180 top
E3  222.25,92.71 180 top
E4  194.31,72.39 180 top
E5  177.8,91.44 180 top
E6  167.64,11.43 180 top
E7  167.64,26.67 180 top
E8  167.64,41.91 180 top
E9  168.91,57.15 180 top
E10  167.64,72.39 180 top
E11  137.16,72.39 180 top
E12  135.89,87.63 180 top
E13  110.49,21.59 180 top
E14  110.49,46.99 180 top
E15  110.49,74.93 180 top
E16  110.49,100.33 180 top
E17  87.63,11.43 180 top
E18  87.63,26.67 180 top
E19  87.63,41.91 180 top
E20  87.63,55.88 180 top
E21  87.63,72.39 180 top
E22  64.77,72.39 180 top
IC2  43.18,25.4 270 top
IC3  43.18,40.64 270 top
J1  71.12,88.9 0 top
JP1  21.59,26.67 180 top
K  110.49,64.77 180 top
LASTDEV  210.82,21.59 90 top
P  110.49,11.43 180 top
PAD1  177.8,63.5 180 top
PAD2  175.26,63.5 180 top
PAD3  172.72,63.5 180 top
PAD4  170.18,63.5 180 top
PAD5  167.64,63.5 180 top
PAD6  165.1,63.5 180 top
PAD7  162.56,63.5 180 top
PAD8  160.02,63.5 180 top
PAD9  177.8,50.8 180 top
PAD18  73.66,78.74 180 top
PAD19  71.12,78.74 180 top
PAD28  68.58,78.74 180 top
PAD29  66.04,78.74 180 top
PAD30  63.5,78.74 180 top
PAD31  60.96,78.74 180 top
PAD32  58.42,78.74 180 top
PAD33  55.88,78.74 180 top
PAD34  73.66,66.04 180 top
PAD35  71.12,66.04 180 top
PAD36  68.58,66.04 180 top
PAD37  66.04,66.04 180 top
PAD38  63.5,66.04 180 top
PAD39  60.96,66.04 180 top
PAD40  58.42,66.04 180 top
PAD41  55.88,66.04 180 top
PAD42  175.26,50.8 180 top
PAD43  172.72,50.8 180 top
PAD44  170.18,50.8 180 top
PAD45  167.64,50.8 180 top
PAD46  165.1,50.8 180 top
PAD47  162.56,50.8 180 top
PAD48  160.02,50.8 180 top
Q1  27.94,81.28 0 top
Q2  27.94,60.96 0 top
R1  220.98,106.68 0 top
R2  220.98,58.42 0 top
R3  17.78,78.74 90 top
R4  12.7,78.74 90 top
R5  35.56,76.2 180 top
R6  20.32,68.58 0 top
R7  35.56,55.88 180 top
R8  17.78,58.42 90 top
R9  15.24,58.42 90 top
R10  20.32,48.26 0 top
R11  43.18,88.9 180 top
R12  15.24,78.74 90 top
R13  43.18,86.36 0 top
R14  43.18,78.74 0 top
STOPB  193.04,106.68 0 top
T  110.49,36.83 180 top
U$1  [3,6]  237.49,3.81 0 top
U$2  [3,6]  237.49,110.49 0 top
U$3  [3,6]  3.81,110.49 0 top
U$4  [3,6]  3.81,3.81 0 top
U$5  [3,6]  107.95,110.49 0 top
U$6  [3,6]  102.87,3.81 0 top
X1  220.98,62.23 0 top
X2  220.98,102.87 0 top
X3  33.02,100.33 0 top

### Tracks (layer width: path | path; a pad name or v marks a point on that pad's centre or on a via)
24V1
  Top 0.508: JP1.1 25.4,30.48 24V1.P$1
24V2
  Top 0.508: JP1.4 19.05,26.67 19.05,36.2 | 24V.P$1 19.05,36.2 | 19.05,36.2 24V2.P$1
!ACB00
  Bottom 0.406: D34L2.D 62.23,54.61 69.85,54.61 D34L1.D
!ACB01
  Bottom 0.406: D34L2.J 62.23,49.53 69.85,49.53 D34L1.J
!ACB02
  Bottom 0.406: D34L2.N 62.23,44.45 69.85,44.45 D34L1.N
!ACB03
  Bottom 0.406: D34L2.T 62.23,39.37 69.85,39.37 D34L1.T
!ACB04
  Bottom 0.406: E19.5 78.74,33.02 D34L1.X 69.85,34.29 62.23,34.29 D34L2.X
!ACB05  (via drill 0.81)
  Top 0.406: E17.3 81.92,19.68 v81.92,27.94
  Bottom 0.406: v81.92,27.94 D34L1.BB 69.85,29.21 62.23,29.21 D34L2.BB
!ACB06  (via drill 0.81)
  Top 0.406: v86.36,25.4 E18.3
  Bottom 0.406: v86.36,25.4 85.09,24.13 72.39,24.13 | D34L1.FF 72.39,24.13 | D34L2.FF 62.23,24.13 72.39,24.13
!ACB07
  Bottom 0.406: E18.5 78.74,17.78 D34L1.LL 69.85,19.05 62.23,19.05 D34L2.LL
!ACB08
  Bottom 0.406: E17.5 78.74,12.7 D34L1.RR 69.85,13.97 62.23,13.97 D34L2.RR
!ACB09
  Bottom 0.406: E20.3 85.09,60.96 81.28,60.96 72.39,52.07 | D34L1.F 72.39,52.07 | D34L2.F 62.23,52.07 72.39,52.07
!ACB10
  Bottom 0.406: E20.5 80.01,48.26 73.66,48.26 72.39,46.99 | D34L1.L 72.39,46.99 | D34L2.L 62.23,46.99 72.39,46.99
!ACB11
  Bottom 0.406: E19.3 85.09,46.99 77.47,46.99 72.39,41.91 | D34L1.R 72.39,41.91 | D34L2.R 62.23,41.91 72.39,41.91
!ACCLEAR  (via drill 0.81)
  Top 0.406: E21.3 87.63,74.93 v87.63,27.94
  Bottom 0.406: v87.63,27.94 86.36,26.67 72.39,26.67 | D34L1.DD 72.39,26.67 | D34L2.DD 62.23,26.67 72.39,26.67
!B  (via drill 0.81)
  Top 0.406: B.16 B.14 B.12 B.10 B.8 B.6 B.4 B.2 | E6.3 168.91,16.51 168.91,81.92 170.18,83.19 v170.18,87.63
  Bottom 0.406: v170.18,87.63 168.91,88.9 B.2
!BINIT
  Top 0.406: 171.45,39.37 E8.13 | 171.45,39.37 171.45,74.93 E10.3 | D36L2.TT 189.23,8.89 189.23,6.99 188.59,6.35 176.53,6.35 176.53,9.53 171.45,14.61 171.45,39.37
  Bottom 0.406: 209.55,11.43 208.28,10.16 D36L1.TT | 209.55,11.43 LASTDEV.2 | D36L2.TT 191.77,11.43 209.55,11.43
!BMB03
  Bottom 0.406: D35L2.T 135.89,39.37 144.78,39.37 D35L1.T
!BMB04
  Bottom 0.406: D35L2.BB 135.89,29.21 144.78,29.21 D35L1.BB
!BMB05
  Bottom 0.406: D35L2.LL 135.89,19.05 144.78,19.05 D35L1.LL
!BMB06
  Bottom 0.406: D35L2.F 135.89,52.07 144.78,52.07 D35L1.F
!BMB07
  Bottom 0.406: D35L2.R 135.89,41.91 144.78,41.91 D35L1.R
!BMB08
  Bottom 0.406: D35L2.Z 135.89,31.75 144.78,31.75 D35L1.Z
!BRUN
  Bottom 0.406: D34L2.JJ 62.23,21.59 69.85,21.59 D34L1.JJ
!INT_RQ
  Bottom 0.406: D34L2.Z 62.23,31.75 69.85,31.75 D34L1.Z
!IOS
  Top 0.406: E4.3 193.04,71.12 E4.5 191.77,67.31 191.77,6.99 188.59,3.81 107.31,3.81 107.31,5.71 104.78,8.26 95.25,8.26 93.34,6.35 72.39,6.35 72.39,34.29 D34L1.V
  Bottom 0.406: D34L2.V 62.23,36.83 69.85,36.83 D34L1.V
!K  (via drill 0.81)
  Top 0.406: K.16 K.14 K.12 K.10 K.8 K.6 K.4 K.2 | v153.03,21.59 150.5,24.13 v150.5,59.69
  Bottom 0.406: E6.2 166.37,21.59 v153.03,21.59 | v150.5,59.69 146.69,63.5 K.2
!KCC  (via drill 0.81)
  Top 0.406: E8.12 E7.3 | E5.18 160.02,100.33 172.72,100.33 172.72,78.74 E10.1 176.53,74.93 v176.53,36.83
  Bottom 0.406: E8.12 171.45,36.83 v176.53,36.83
!P
  Top 0.406: P.16 P.14 P.12 P.10 P.8 P.6 P.4 P.2
  Bottom 0.406: E6.5 162.56,12.7 150.5,12.7 146.69,8.89 122.56,8.89 121.28,10.16 P.2
!RXL  (via drill 0.81)
  Top 0.406: R14.2 54.61,72.39 v54.61,9.53
  Bottom 0.406: v54.61,9.53 57.78,6.35 99.06,6.35 100.97,8.26 121.92,8.26 123.83,6.35 166.37,6.35 E6.11
!T
  Top 0.406: T.16 T.14 T.12 T.10 T.8 T.6 T.4 T.2 119.38,32.38 123.19,28.57 123.19,5.08 172.09,5.08 173.99,6.99 173.99,8.89 168.91,8.89 E6.6
!TCF  (via drill 0.81)
  Top 0.406: v147.96,40.64 147.32,41.27 147.32,57.15 145.41,59.05 145.41,67.31 146.05,67.94 146.05,74.93 E11.1
  Bottom 0.406: E7.6 161.29,29.21 159.38,29.21 v147.96,40.64
!TPC
  Top 0.406: E7.8 158.75,24.13 E5.23
+24V
  Bottom 0.508: JP1.2 25.4,27.94 IC2.1
-15V
  Top 0.508: R12.1 R4.1 | R12.1 R3.1 | R12.1 D2.A R6.1 13.97,67.31 13.97,54.61 R9.1 | R10.1 D4.A R9.1 | R8.1 R9.1
  Bottom 0.508: R8.1 IC3.3
-24V
  Bottom 0.508: JP1.3 28.57,36.2 33.02,36.2 34.92,38.1 34.92,40.64 IC3.2
B110
  Top 0.406: E3.1 232.41,95.25 232.41,85.09 BAUD.1
B150
  Top 0.406: E2.15 227.33,69.85 227.33,82.55 BAUD.3
B300
  Top 0.406: E2.13 222.25,69.85 222.25,81.92 222.88,82.55 226.06,82.55 BAUD.5
B600
  Top 0.406: E2.14 227.33,67.31 229.87,67.31 229.87,84.45 229.24,85.09 223.52,85.09 BAUD.7
B1200
  Top 0.406: E2.6 214.63,80.01 214.63,84.45 215.26,85.09 220.98,85.09 BAUD.9
B2400
  Bottom 0.406: E2.4 219.71,80.01 217.81,80.01 217.17,80.64 217.17,83.82 BAUD.11
B4800
  Top 0.406: E2.5 219.71,77.47 219.71,81.92 219.07,82.55 215.9,82.55 BAUD.13
B9600
  Top 0.406: E2.7 212.09,80.01 212.09,82.55 BAUD.15
BAC00
  Bottom 0.406: D36L2.D 198.75,53.34 200.03,54.61 201.29,54.61 202.56,53.34 D36L1.D
BAC01
  Bottom 0.406: D36L2.J 191.77,49.53 201.93,49.53 D36L1.J
BAC02
  Bottom 0.406: D36L2.N 198.75,43.18 200.03,44.45 201.93,44.45 D36L1.N
BAC03
  Bottom 0.406: D36L2.T 191.77,39.37 201.93,39.37 D36L1.T
BAC04  (via drill 0.81)
  Top 0.406: v215.9,35.56 E1.17
  Bottom 0.406: v215.9,35.56 214.63,34.29 206.38,34.29 205.1,33.02 D36L1.X 201.93,34.29 191.77,34.29 D36L2.X
BAC05
  Bottom 0.406: E1.15 220.98,29.21 204.47,29.21 | D36L1.BB 204.47,29.21 | D36L2.BB 191.77,29.21 204.47,29.21
BAC06  (via drill 0.81)
  Top 0.406: v204.47,34.29 204.47,24.13 D36L1.FF
  Bottom 0.406: v204.47,34.29 E1.13 | D36L2.FF 191.77,24.13 201.93,24.13 D36L1.FF
BAC07
  Top 0.406: E1.11 205.74,40.64 205.74,20.32 D36L1.LL
  Bottom 0.406: D36L2.LL 191.77,19.05 201.93,19.05 D36L1.LL
BAC08
  Top 0.406: E1.8 214.63,52.07 214.63,17.14 211.46,13.97 203.2,13.97 D36L1.RR
  Bottom 0.406: D36L2.RR 191.77,13.97 201.93,13.97 D36L1.RR
BAC09  (via drill 0.81)
  Top 0.406: v220.98,50.8 E1.6
  Bottom 0.406: v220.98,50.8 D36L1.F 201.93,52.07 191.77,52.07 D36L2.F
BAC10
  Bottom 0.406: E1.4 227.33,52.07 228.6,52.07 229.87,50.8 229.87,44.45 227.97,44.45 227.33,45.09 227.33,48.26 205.74,48.26 204.47,46.99 | D36L1.L 204.47,46.99 | D36L2.L 191.77,46.99 204.47,46.99
BAC11  (via drill 0.81)
  Top 0.406: v224.79,46.99 E1.2
  Bottom 0.406: v224.79,46.99 209.55,46.99 204.47,41.91 | D36L1.R 204.47,41.91 | D36L2.R 191.77,41.91 204.47,41.91
BCLK  (via drill 0.81)
  Top 0.406: BAUD.14 BAUD.12 | BAUD.6 BAUD.8 | E5.17 162.56,97.79 v162.56,87.63
  Bottom 0.406: BAUD.14 BAUD.16 210.82,83.82 E5.40 199.39,86.36 163.83,86.36 v162.56,87.63 | BAUD.12 BAUD.10 BAUD.8 | BAUD.6 BAUD.4 BAUD.2
BIOP1
  Top 0.406: LASTDEV.7 212.09,26.67 212.09,46.35 211.46,46.99 204.47,46.99 204.47,36.83 D36L1.V
  Bottom 0.406: 166.37,36.83 168.91,34.29 189.23,34.29 D36L2.V 191.77,36.83 201.93,36.83 D36L1.V | 166.37,36.83 E8.10 | E8.2 168.91,41.91 161.93,41.91 158.75,38.73 158.75,36.83 166.37,36.83
BIOP2
  Top 0.406: LASTDEV.6 204.47,16.51 201.93,16.51 201.93,29.21 D36L1.Z
  Bottom 0.406: E7.5 166.37,31.75 171.45,31.75 E7.2 173.99,29.21 189.23,29.21 D36L2.Z 191.77,31.75 201.93,31.75 D36L1.Z
BIOP4
  Top 0.406: E7.10 163.83,24.13 163.83,44.45 E8.5
  Bottom 0.406: LASTDEV.5 205.74,25.4 D36L1.DD 201.93,26.67 191.77,26.67 D36L2.DD 189.23,24.13 166.37,24.13 E7.10
BMB00
  Bottom 0.406: D35L2.D 135.89,54.61 144.78,54.61 D35L1.D
BMB01
  Bottom 0.406: D35L2.J 135.89,49.53 144.78,49.53 D35L1.J
BMB02
  Bottom 0.406: D35L2.N 135.89,44.45 144.15,44.45 145.41,43.18 D35L1.N
BMB03  (via drill 0.81)
  Top 0.406: v121.92,80.01 123.19,78.74 v123.19,31.75
  Bottom 0.406: E13.3 120.65,31.75 v123.19,31.75 133.35,31.75 D35L2.X 135.89,34.29 144.78,34.29 D35L1.X | E15.3 115.57,80.01 v121.92,80.01
BMB04  (via drill 0.81)
  Top 0.406: v119.38,22.86 E13.2 | v116.84,73.03 E15.2 | v134.62,64.77 135.89,63.5 135.89,24.13 D35L2.FF
  Bottom 0.406: v119.38,22.86 120.65,21.59 133.35,21.59 D35L2.FF 135.89,24.13 144.78,24.13 D35L1.FF | v116.84,73.03 118.11,71.75 118.11,69.85 132.72,69.85 133.35,69.22 133.35,64.77 v134.62,64.77
BMB05  (via drill 0.81)
  Top 0.406: E13.1 120.65,24.13 v120.65,15.24 | v131.44,78.74 133.35,76.83 133.35,13.97 D35L2.RR
  Bottom 0.406: v120.65,15.24 121.92,13.97 133.35,13.97 | D35L2.RR 133.35,13.97 | v131.44,78.74 E15.1 | D35L1.RR 144.78,13.97 133.35,13.97
BMB06
  Top 0.406: E16.3 114.3,102.87 113.03,101.6 105.41,101.6 105.41,104.78 104.78,105.41 102.87,105.41 102.87,100.97 99.06,97.16 99.06,64.14 111.12,52.07 114.3,52.07 E14.3
  Bottom 0.406: E14.3 118.11,46.99 133.35,46.99 | D35L2.L 133.35,46.99 | D35L1.L 144.78,46.99 133.35,46.99
BMB07  (via drill 0.81)
  Top 0.406: E16.2 118.11,105.41 124.46,105.41 v124.46,55.88
  Bottom 0.406: 115.57,52.07 E14.2 | 115.57,52.07 113.67,52.07 113.03,51.44 113.03,45.72 122.56,45.72 131.44,36.83 133.35,36.83 | D35L2.V 133.35,36.83 | v124.46,55.88 120.65,52.07 115.57,52.07 | D35L1.V 144.78,36.83 133.35,36.83
BMB08  (via drill 0.81)
  Top 0.406: 120.65,52.07 E14.1 | 120.65,52.07 120.65,85.72 121.92,87 121.92,95.89 119.38,98.42 E16.1 | v126.36,26.67 120.65,32.38 120.65,52.07
  Bottom 0.406: D35L1.DD 144.78,26.67 135.89,26.67 D35L2.DD 133.35,26.67 v126.36,26.67
BMB09
  Bottom 0.406: D35L2.JJ 135.89,21.59 144.78,21.59 D35L1.JJ
BMB10
  Bottom 0.406: D35L2.NN 141.6,15.24 142.88,16.51 144.78,16.51 D35L1.NN
BMB11
  Bottom 0.406: D35L2.TT 135.89,11.43 144.78,11.43 D35L1.TT
BTS1
  Top 0.406: D36L1.NN LASTDEV.3
  Bottom 0.406: D36L2.NN 191.77,16.51 201.93,16.51 D36L1.NN
BTS3
  Bottom 0.406: LASTDEV.4 208.28,20.32 D36L1.JJ 201.93,21.59 191.77,21.59 D36L2.JJ
CS8
  Top 0.406: 5/8.2 198.12,101.6 198.12,85.09 E5.38
  Bottom 0.406: E5.38 E5.37
GND  (via drill 0.81)
  Top 0.508: E5.4 E5.3 196.85,102.87 5/8.1 | C29.2 233.68,96.52 C6.2 | E3.8 C28.2 | E1.19 236.22,50.8 C4.2 | E1.10 212.09,54.61 212.09,62.23 C30.2 | C5.2 232.41,73.66 232.41,67.31 229.87,64.77 | C31.2 229.87,64.77 | E1.1 229.87,57.15 229.87,64.77 | E2.12 E2.8 | E4.4 STOPB.1 | D36L2.UU D36L2.SS D36L2.PP D36L2.MM D36L2.KK D36L2.HH D36L2.EE D36L2.CC D36L2.AA D36L2.Y D36L2.W D36L2.U D36L2.S D36L2.P D36L2.M D36L2.K D36L2.H D36L2.E D36L2.C D36L2.A | E6.7 161.29,16.51 161.29,26.67 160.02,27.94 E7.7 160.02,31.11 161.29,32.38 161.29,44.45 E8.7 | LASTDEV.1 C23.- 223.52,12.7 C22.2 | D36L1.A D36L1.C D36L1.E D36L1.H D36L1.K D36L1.M D36L1.P D36L1.S D36L1.U D36L1.W D36L1.Y D36L1.AA D36L1.CC D36L1.EE D36L1.HH D36L1.KK D36L1.MM D36L1.PP D36L1.SS D36L1.UU | E15.5 E15.4 | E20.4 86.36,62.23 E21.6 86.36,73.66 E21.4 | C21.2 76.2,87.63 | J1.G1 76.2,88.9 76.2,87.63 | 76.2,87.63 J1.5 | E16.5 E16.4 | 146.05,87.63 147.32,88.9 C14.2 | 146.05,87.63 144.78,86.36 | 144.78,86.36 E12.15 | C13.2 146.05,76.2 146.05,77.47 | 146.05,87.63 146.05,77.47 | v163.83,96.52 E5.16 | v167.64,72.39 E10.11 | C26.1 140.97,99.06 140.97,90.17 144.78,86.36 | D34L1.A 68.58,54.61 | 68.58,54.61 D34L1.C D34L1.E D34L1.H D34L1.K D34L1.M D34L1.P D34L1.S D34L1.U D34L1.W D34L1.Y D34L1.AA D34L1.CC D34L1.EE D34L1.HH D34L1.KK D34L1.MM D34L1.PP D34L1.SS D34L1.UU | IC2.2 31.11,27.3 31.11,41.27 IC3.1 | D34L2.A 58.42,54.61 | 58.42,54.61 D34L2.C D34L2.E D34L2.H D34L2.K D34L2.M D34L2.P D34L2.S D34L2.U D34L2.W D34L2.Y D34L2.AA D34L2.CC D34L2.EE D34L2.HH D34L2.KK D34L2.MM D34L2.PP D34L2.SS D34L2.UU | 58.42,54.61 68.58,54.61 | E14.4 E14.5 | E13.4 E13.5 | C16.2 101.6,21.59 E13.8
  Top 0.508: 143.51,8.89 D35L1.SS D35L1.PP D35L1.MM D35L1.KK D35L1.HH D35L1.EE D35L1.CC D35L1.AA D35L1.Y D35L1.W D35L1.U D35L1.S D35L1.P D35L1.M D35L1.K D35L1.H D35L1.E D35L1.C D35L1.A 143.51,77.47 146.05,77.47 | 143.51,8.89 D35L1.UU | E11.7 130.81,74.93 130.81,57.15 D35L2.A D35L2.C D35L2.E D35L2.H D35L2.K D35L2.M D35L2.P D35L2.S D35L2.U D35L2.W D35L2.Y D35L2.AA D35L2.CC D35L2.EE D35L2.HH D35L2.KK D35L2.MM D35L2.PP D35L2.SS 132.08,8.89 | 132.08,8.89 D35L2.UU | 132.08,8.89 143.51,8.89 | C19.2 92.71,57.15 92.71,45.72 C18.2
  Bottom 0.508: STOPB.1 196.85,100.33 E5.3 201.93,93.98 C8.2 207.01,96.52 E3.8 E3.12 | C28.2 C29.2 | C15.2 179.07,76.2 E4.4 191.77,74.93 C7.2 201.93,76.2 E2.8 | E1.1 234.95,52.07 C4.2 | 219.71,67.31 215.9,63.5 C30.2 | 219.71,67.31 E2.12 | C31.2 224.79,67.31 219.71,67.31 | E7.12 E7.13 180.34,15.24 | C1.2 179.07,15.24 180.34,15.24 | D36L2.MM 180.34,15.24 | 179.07,33.02 C2.2 | D36L2.W 179.07,33.02 | C3.2 179.07,45.72 D36L2.K | E7.7 162.56,33.02 179.07,33.02 | LASTDEV.1 209.55,8.89 201.93,8.89 | D36L1.SS 201.93,8.89 | D36L2.UU 189.23,8.89 201.93,8.89 | E1.10 209.55,54.61 202.56,54.61 201.29,55.88 D36L1.A | 52.07,85.09 55.88,88.9 J1.G1 | 52.07,85.09 D6.A | 52.07,85.09 33.66,85.09 18.41,100.33 X3.1 | J1.G2 78.11,88.9 76.83,87.63 J1.5 | E15.5 107.95,80.01 102.87,80.01 E15.8 100.33,77.47 85.09,77.47 E21.4 77.47,76.2 C21.2 C20.2 | C11.2 113.03,77.47 E15.4 | E21.6 E21.7 | C19.2 85.09,58.42 E20.4 | E16.8 102.87,102.87 107.95,102.87 E16.5 | C26.1 130.81,102.87 C12.2 113.03,102.87 E16.4 | C13.2 158.75,74.93 E10.7 161.29,77.47 163.83,77.47 163.83,75.56 164.47,74.93 165.1,74.93 v167.64,72.39 | v163.83,96.52 162.56,95.25 152.4,95.25 C14.2 | IC3.1 35.56,45.72 D34L2.K | 100.33,49.53 99.06,49.53 C18.2 85.09,44.45 | E14.8 100.33,49.53 | 85.09,44.45 E19.4 | E14.5 107.95,49.53 100.33,49.53 | C16.2 85.09,13.97 E17.4 82.55,16.51 69.85,16.51 D34L1.KK | 100.33,26.67 97.79,29.21 C17.2 85.09,29.21 E18.4 85.09,30.48 85.09,44.45 | 100.33,26.67 E13.8 | E13.5 107.95,26.67 100.33,26.67 | C10.2 123.19,50.8 D35L2.E | D35L2.CC 123.19,25.4 C9.2 113.03,24.13 E13.4 | E8.7 158.75,44.45 145.41,44.45 144.15,45.72 D35L1.K
KB
  Top 0.406: E6.1 173.99,16.51 173.99,29.21 | E7.1 173.99,29.21 | E8.1 173.99,44.45 173.99,29.21
  Bottom 0.406: E8.4 168.91,46.99 173.99,46.99 E8.1
KBF  (via drill 0.81)
  Top 0.406: v161.29,93.98 E5.19 | v193.04,90.17 195.58,87.63 195.58,78.74 E4.1
  Bottom 0.406: v161.29,93.98 165.1,90.17 v193.04,90.17
KCC
  Bottom 0.406: E21.2 E21.1 122.56,76.2 123.83,77.47 132.72,77.47 135.25,80.01 168.91,80.01 E10.2
KRS  (via drill 0.81)
  Top 0.406: E17.7 E17.2 E18.7 E18.2 E19.7 E19.2 E20.7 E20.2 | v149.22,55.88 148.59,56.52 v148.59,59.69
  Bottom 0.406: E8.6 152.4,55.88 v149.22,55.88 | v148.59,59.69 147.32,60.96 90.17,60.96 E20.2
KSF  (via drill 0.81)
  Top 0.406: v195.58,54.61 196.85,55.88 196.85,74.93 E4.2
  Bottom 0.406: E8.3 168.91,44.45 167,44.45 166.37,45.09 166.37,54.61 v195.58,54.61
MR
  Top 0.406: E5.21 156.21,86.36 167.64,86.36 E10.4
N$1
  Top 0.406: E16.9 104.14,93.98 B.13
N$2
  Top 0.406: PAD1.1 E9.1
N$3
  Top 0.406: PAD2.1 E9.2
N$4
  Top 0.406: PAD3.1 E9.3
N$5
  Top 0.406: E16.15 119.38,93.98 B.1
N$6
  Top 0.406: E16.14 116.84,93.98 B.3
N$7
  Top 0.406: E16.13 114.3,93.98 B.5
N$8
  Top 0.406: E16.12 111.76,93.98 B.7
N$9
  Top 0.406: E16.11 109.22,93.98 B.9
N$10
  Top 0.406: E16.10 106.68,93.98 B.11
N$11
  Top 0.406: E16.7 104.14,100.97 100.33,97.16 100.33,92.71 B.15
N$12
  Top 0.406: PAD4.1 E9.4
N$13
  Top 0.406: C29.1 R1.2 223.52,104.14 223.52,102.87 X2.2 222.88,102.87 222.25,102.23 222.25,92.71 E3.11
N$14
  Top 0.406: C28.1 R1.1 218.44,104.14 218.44,102.87 | E3.10 217.17,90.17 217.17,101.6 218.44,102.87 | 218.44,102.87 X2.1
N$15
  Top 0.508: E12.6 129.54,93.98 C26.2
N$16
  Top 0.508: C27.1 E12.2
N$17
  Top 0.406: Q1.2 R5.2
N$18
  Top 0.406: D1.A R3.2
  Bottom 0.406: D1.A Q1.3
N$19
  Top 0.406: Q2.2 R7.2
N$20
  Top 0.406: R8.2 D3.A Q2.3
N$21
  Top 0.406: PAD5.1 E9.5
N$22
  Top 0.406: E12.5 132.08,93.98 C24.2
N$23
  Top 0.406: 215.9,59.69 218.44,62.23 X1.1 | R2.1 215.9,59.69 | 215.9,59.69 E2.10
  Bottom 0.406: R2.1 C30.1
N$24
  Top 0.406: D6.C R14.1 | R13.2 D5.A
  Bottom 0.406: D6.C 40.64,83.82 D5.A
N$25
  Top 0.406: C31.1 R2.2 226.06,59.69 223.52,62.23 X1.2 222.88,62.23 222.88,64.14 E2.11
N$26  (via drill 0.81)
  Top 0.406: E8.11 166.37,39.37 166.37,55.24 161.29,60.33 v161.29,62.23
  Bottom 0.406: v161.29,62.23 149.22,62.23 142.88,68.58 E11.13
N$27  (via drill 0.81)
  Top 0.406: v154.31,66.67 v154.31,11.43
  Bottom 0.406: E6.12 166.37,11.43 v154.31,11.43 | v154.31,66.67 156.21,68.58 E10.8
N$29
  Bottom 0.406: E11.11 140.97,72.39 158.75,72.39 E10.6
N$30
  Bottom 0.508: E10.10 166.37,69.85 171.45,69.85 E10.13
N$31
  Top 0.406: PAD6.1 E9.6
N$32
  Top 0.406: C25.2 E12.3
N$33
  Top 0.406: PAD7.1 E9.7
N$34
  Top 0.406: PAD18.1 E22.1
N$35
  Top 0.406: PAD8.1 E9.8
N$37
  Top 0.406: PAD9.1 E9.16
N$38
  Top 0.406: PAD42.1 E9.15
N$39
  Top 0.406: PAD43.1 E9.14
N$40
  Top 0.406: PAD44.1 E9.13
N$41
  Top 0.406: PAD19.1 E22.2
N$42
  Top 0.406: PAD45.1 E9.12
N$43
  Top 0.406: PAD28.1 E22.3
N$44
  Top 0.406: C24.1 E12.4
N$45
  Top 0.406: C25.1 E12.1
N$46
  Top 0.406: PAD46.1 E9.11
N$47
  Top 0.406: PAD47.1 E9.10
N$48
  Top 0.406: PAD48.1 E9.9
N$49
  Top 0.406: E14.15 119.38,40.64 T.1
N$50
  Top 0.406: PAD29.1 E22.4
N$51
  Top 0.406: PAD30.1 E22.5
N$52
  Top 0.406: PAD31.1 E22.6
N$53
  Top 0.406: PAD32.1 E22.7
N$54
  Top 0.406: PAD33.1 E22.8
N$55
  Top 0.406: PAD34.1 E22.16
N$56
  Top 0.406: PAD35.1 E22.15
N$57
  Top 0.406: PAD36.1 E22.14
N$58
  Top 0.406: PAD37.1 E22.13
N$59
  Top 0.406: PAD38.1 E22.12
N$60  (via drill 0.81)
  Top 0.508: E6.9 E6.8 157.48,10.16 v157.48,66.67
  Bottom 0.508: E10.12 168.28,66.67 v157.48,66.67
N$61
  Top 0.406: PAD39.1 E22.11
N$68
  Top 0.406: PAD40.1 E22.10
N$69
  Top 0.406: PAD41.1 E22.9
N$90
  Top 0.406: E15.15 119.38,68.58 K.1
N$91
  Top 0.406: E15.14 116.84,68.58 K.3
N$97
  Top 0.406: E15.13 114.3,68.58 K.5
N$109
  Top 0.406: E15.12 111.76,68.58 K.7
N$112
  Top 0.406: E15.11 109.22,68.58 K.9
N$113
  Top 0.406: E15.10 106.68,68.58 K.11
N$114
  Top 0.406: E15.7 100.33,74.93 100.33,67.31 K.15
N$115
  Top 0.406: E15.9 104.14,68.58 K.13
N$116
  Top 0.406: E14.14 116.84,40.64 T.3
N$117
  Top 0.406: E14.13 114.3,40.64 T.5
N$118
  Top 0.406: E14.12 111.76,40.64 T.7
N$119
  Top 0.406: E14.11 109.22,40.64 T.9
N$120
  Top 0.406: E14.10 106.68,40.64 T.11
N$121
  Top 0.406: E14.7 100.33,46.99 100.33,39.37 T.15
N$122
  Top 0.406: E14.9 104.14,40.64 T.13
N$123
  Top 0.406: E13.15 119.38,15.24 P.1
N$124
  Top 0.406: E13.14 116.84,15.24 P.3
N$125
  Top 0.406: E13.13 114.3,15.24 P.5
N$126
  Top 0.406: E13.12 111.76,15.24 P.7
N$127
  Top 0.406: E13.11 109.22,15.24 P.9
N$128
  Top 0.406: E13.10 106.68,15.24 P.11
N$129
  Top 0.406: E13.7 102.87,24.13 102.87,20.95 100.33,18.41 100.33,13.97 P.15
N$130
  Top 0.406: E13.9 104.14,15.24 P.13
PT
  Top 0.406: 166.37,19.05 167.64,17.78 E6.4 | 166.37,19.05 E7.9 162.56,26.67 161.29,27.94 161.29,31.11 162.56,32.38 E8.9 | E7.4 166.37,29.21 166.37,19.05
RBR1
  Top 0.406: E19.1 90.17,46.99 90.17,94.61 102.23,106.68 105.41,106.68 106.05,106.05 113.03,106.05 113.67,106.68 180.34,106.68 180.34,98.42 179.71,97.79 173.99,97.79 E5.12
RBR2  (via drill 0.81)
  Top 0.406: E20.6 82.55,55.88 82.55,80.01 v88.9,86.36
  Bottom 0.406: v88.9,86.36 92.71,90.17 145.41,90.17 153.03,97.79 175.26,97.79 E5.11
RBR3  (via drill 0.81)
  Top 0.406: v146.69,59.69 149.86,62.87 149.86,97.16 154.31,101.6 179.07,101.6 E5.10
  Bottom 0.406: v146.69,59.69 E20.1
RBR4  (via drill 0.81)
  Top 0.406: E17.6 80.64,13.34 v80.64,93.98
  Bottom 0.406: v80.64,93.98 92.08,105.41 187.32,105.41 193.04,99.69 193.04,97.79 182.88,97.79 E5.9
RBR5  (via drill 0.81)
  Top 0.406: E18.6 85.09,24.13 v85.09,48.26 | v186.06,57.15 187.96,59.05 187.96,99.69 187.32,100.33 184.15,100.33 E5.8
  Bottom 0.406: v85.09,48.26 87.63,50.8 99.69,50.8 106.05,57.15 v186.06,57.15
RBR6  (via drill 0.81)
  Top 0.406: E18.1 99.06,38.1 v99.06,52.07 | v179.07,59.69 185.42,66.04 185.42,97.79 E5.7
  Bottom 0.406: v99.06,52.07 105.41,58.42 165.74,58.42 167,59.69 v179.07,59.69
RBR7  (via drill 0.81)
  Top 0.406: v135.89,16.51 138.43,19.05 v138.43,92.71
  Bottom 0.406: E17.1 92.71,16.51 v135.89,16.51 | v138.43,92.71 146.05,100.33 187.96,100.33 E5.6
RBR8  (via drill 0.81)
  Top 0.406: v124.46,41.91 125.73,43.18 v125.73,93.98
  Bottom 0.406: E19.6 90.17,41.91 v124.46,41.91 | v125.73,93.98 129.54,97.79 136.53,97.79 140.34,101.6 189.23,101.6 E5.5
RRUN
  Top 0.406: E12.10 128.27,82.55 128.27,69.85 E11.8
  Bottom 0.406: R7.1 52.07,67.31 128.27,67.31 E11.8
RRUN+
  Top 0.406: D4.C R10.2
  Bottom 0.406: D4.C 22.86,50.8 D3.C 19.05,54.61 16.51,54.61 16.51,100.97 17.78,102.23 40.64,102.23 42.55,100.33 X3.6
RRUN-
  Top 0.406: R9.2 26.67,74.93 26.67,85.72 33.02,92.08 X3.4
RTS
  Top 0.406: E12.7 E12.8
  Bottom 0.406: E12.8 125.73,92.71 75.56,92.71 73.03,90.17 J1.8
RX  (via drill 0.81)
  Top 0.406: E6.13 171.45,6.35 155.57,6.35 v155.57,78.74 155.57,80.01 152.4,83.19 152.4,97.79 E5.20
  Bottom 0.406: E10.5 165.1,78.74 v155.57,78.74
RX+
  Top 0.406: R11.1 48.26,100.33 X3.7
  Bottom 0.406: R13.1 40.64,88.9 R11.1
RX-
  Top 0.406: R12.2 27.94,96.52 27.94,100.33 X3.3
RXD  (via drill 0.81)
  Top 0.406: v134.62,81.28 E12.13
  Bottom 0.406: v134.62,81.28 69.85,81.28 64.14,87 64.14,88.9 69.85,88.9 J1.3
RXE  (via drill 0.81)
  Top 0.406: v160.02,85.09 160.02,78.11 161.29,76.83 161.29,69.85 E10.9
  Bottom 0.406: E12.12 137.16,86.36 158.75,86.36 v160.02,85.09
STOPB
  Top 0.406: E5.36 191.77,97.16 193.04,98.42 STOPB.2
TBR1  (via drill 0.81)
  Top 0.406: v167.64,58.42 166.37,59.69 E5.26
  Bottom 0.406: E1.18 228.6,50.8 222.88,50.8 221.62,52.07 212.72,52.07 212.09,52.7 212.09,58.42 v167.64,58.42
TBR2  (via drill 0.81)
  Top 0.406: v171.45,88.9 168.91,88.9 E5.27
  Bottom 0.406: E1.16 226.06,43.18 234.31,43.18 237.49,46.35 237.49,87.63 172.72,87.63 v171.45,88.9
TBR3  (via drill 0.81)
  Top 0.406: v212.09,77.47 212.09,74.3 217.17,69.22 217.17,65.41 219.71,62.87 219.71,46.99 E1.14
  Bottom 0.406: E5.28 172.72,85.09 182.25,85.09 182.88,84.45 182.88,78.74 210.82,78.74 v212.09,77.47
TBR4  (via drill 0.81)
  Top 0.406: v199.39,73.03 208.28,64.14 208.28,51.44 213.36,46.35 E1.12
  Bottom 0.406: E5.29 173.99,73.03 v199.39,73.03
TBR5  (via drill 0.81)
  Top 0.406: v200.66,77.47 209.55,68.58 209.55,52.7 210.19,52.07 213.36,52.07 E1.9
  Bottom 0.406: E5.30 182.88,77.47 v200.66,77.47
TBR6
  Top 0.406: E5.31 182.88,87.63 182.88,100.97 189.87,107.95 210.82,107.95 210.82,67.94 214.63,64.14 214.63,57.15 E1.7
TBR7  (via drill 0.81)
  Top 0.406: v181.61,64.14 E5.32
  Bottom 0.406: v181.61,64.14 186.06,59.69 217.17,59.69 E1.5
TBR8
  Bottom 0.406: E5.33 187.96,80.01 216.53,80.01 219.71,76.83 219.71,71.12 234.31,71.12 234.95,70.48 234.95,54.61 229.87,54.61 E1.3
TPF  (via drill 0.81)
  Top 0.406: v153.03,65.41 151.13,67.31 v151.13,73.66
  Bottom 0.406: E4.6 189.87,65.41 v153.03,65.41 | v151.13,73.66 137.16,73.66 E11.5
TRE  (via drill 0.81)
  Top 0.406: E11.3 140.97,77.47 140.97,87 v141.6,87.63
  Bottom 0.406: v141.6,87.63 159.38,87.63 161.29,85.72 E5.24
TSF  (via drill 0.81)
  Top 0.406: v193.04,44.45 194.31,45.72 194.31,67.31 E4.7
  Bottom 0.406: E8.8 162.56,40.64 183.51,40.64 187.32,44.45 v193.04,44.45
TX  (via drill 0.81)
  Top 0.406: v102.87,82.55 v100.33,80.01
  Bottom 0.406: R5.1 44.45,80.01 v100.33,80.01 | 130.81,82.55 v102.87,82.55 | E12.11 130.81,82.55 | E5.25 162.56,82.55 130.81,82.55
TX+
  Top 0.406: D2.C R6.2 | D1.C 20.32,80.64 29.84,90.17 29.84,102.87 34.92,102.87 37.47,100.33 X3.5
  Bottom 0.406: D1.C 22.86,71.12 D2.C
TX-
  Top 0.406: R4.2 22.86,93.98 22.86,100.33 X3.2
TXD  (via drill 0.81)
  Top 0.406: v139.7,87.63 E12.14
  Bottom 0.406: v139.7,87.63 92.08,87.63 89.53,85.09 71.12,85.09 68.58,87.63 J1.2
VCC
  Top 0.508: C22.1 C23.+ 223.52,35.56 E1.20 | C6.1 234.95,88.9 234.95,71.12 C5.1 237.49,66.04 237.49,48.26 C4.1 | 176.53,24.13 177.8,25.4 C2.1 177.8,29.84 175.26,32.38 E8.14 | 176.53,24.13 E7.14 | C1.1 177.8,12.06 176.53,13.34 176.53,24.13 | 5/8.3 205.74,102.87 E5.1 203.2,97.79 203.2,87.63 | C8.1 203.2,87.63 | 203.2,87.63 E5.39 199.39,75.56 198.12,74.3 198.12,72.39 C7.1 | C3.1 184.78,46.35 184.78,64.14 186.69,66.04 E5.34 | Q1.1 29.21,77.47 29.21,59.69 Q2.1 27.94,27.94 IC2.3 | R11.2 39.37,87.63 39.37,85.09 D5.C | E16.6 107.95,102.87 113.03,102.87 113.03,104.78 113.67,105.41 115.57,105.41 115.57,100.33 E16.16 120.65,95.25 120.65,87 118.11,84.45 118.11,80.01 | E15.6 107.95,80.01 118.11,80.01 | 118.11,80.01 118.11,72.39 E15.16 | C27.2 148.59,97.79 148.59,86.36 C14.1 | E11.10 137.16,71.12 E11.4 | E11.12 139.7,73.66 E11.2 142.24,81.28 E12.16 | C16.1 92.71,10.16 92.71,21.59 E18.8 | C19.1 95.25,53.34 | 95.25,53.34 104.14,53.34 E14.6 106.68,49.53 113.03,49.53 E14.16 | C18.1 95.25,40.64 95.25,53.34 | E21.8 95.25,64.77 95.25,53.34 | C17.1 90.17,27.94 90.17,36.83 E19.8
  Bottom 0.508: E1.20 234.95,46.99 C4.1 | C5.1 232.41,69.85 E2.16 229.87,69.85 C7.1 199.39,69.85 | E3.16 232.41,90.17 C6.1 | 199.39,69.85 E4.8 | 199.39,69.85 C15.1 176.53,69.85 E10.14 172.72,71.12 148.59,71.12 C13.1 144.78,69.85 | E8.14 176.53,39.37 C3.1 | E6.14 176.53,8.89 C1.1 | STOPB.3 201.93,100.33 E5.1 | E5.34 E5.35 190.5,85.09 198.12,85.09 E5.39 | 34.29,80.01 33.02,78.74 Q1.1 | 34.29,80.01 D5.C | E16.16 120.65,97.79 C12.1 | 120.02,71.75 120.65,72.39 C11.1 123.19,71.12 132.72,71.12 136.53,67.31 | 120.02,71.75 E15.16 | E12.16 146.05,85.09 C14.1 | 144.78,69.85 140.97,69.85 E11.12 138.43,67.31 136.53,67.31 | 144.78,69.85 E11.14 | E11.10 135.89,67.31 136.53,67.31 | C9.1 120.65,19.05 E13.16 114.3,22.86 109.22,22.86 E13.6 105.41,24.13 C17.1 92.71,24.13 E18.8 | E17.8 92.71,8.89 C16.1 | 92.71,69.85 E21.8 | 92.71,69.85 C20.1 98.42,74.3 117.47,74.3 120.02,71.75 | 92.71,69.85 C21.1 44.45,69.85 34.29,80.01 | E14.16 120.65,44.45 C10.1 | E19.8 92.71,39.37 C18.1 | E20.8 92.71,53.34 C19.1

### Text on the board
Bottom: Posibus Serial Interface | VRS
tPlace: Posibus Serial Interface | VRS